# EAGLE design mb_01 (EAGLE 7.6.0)

## Sheet 1 of 6
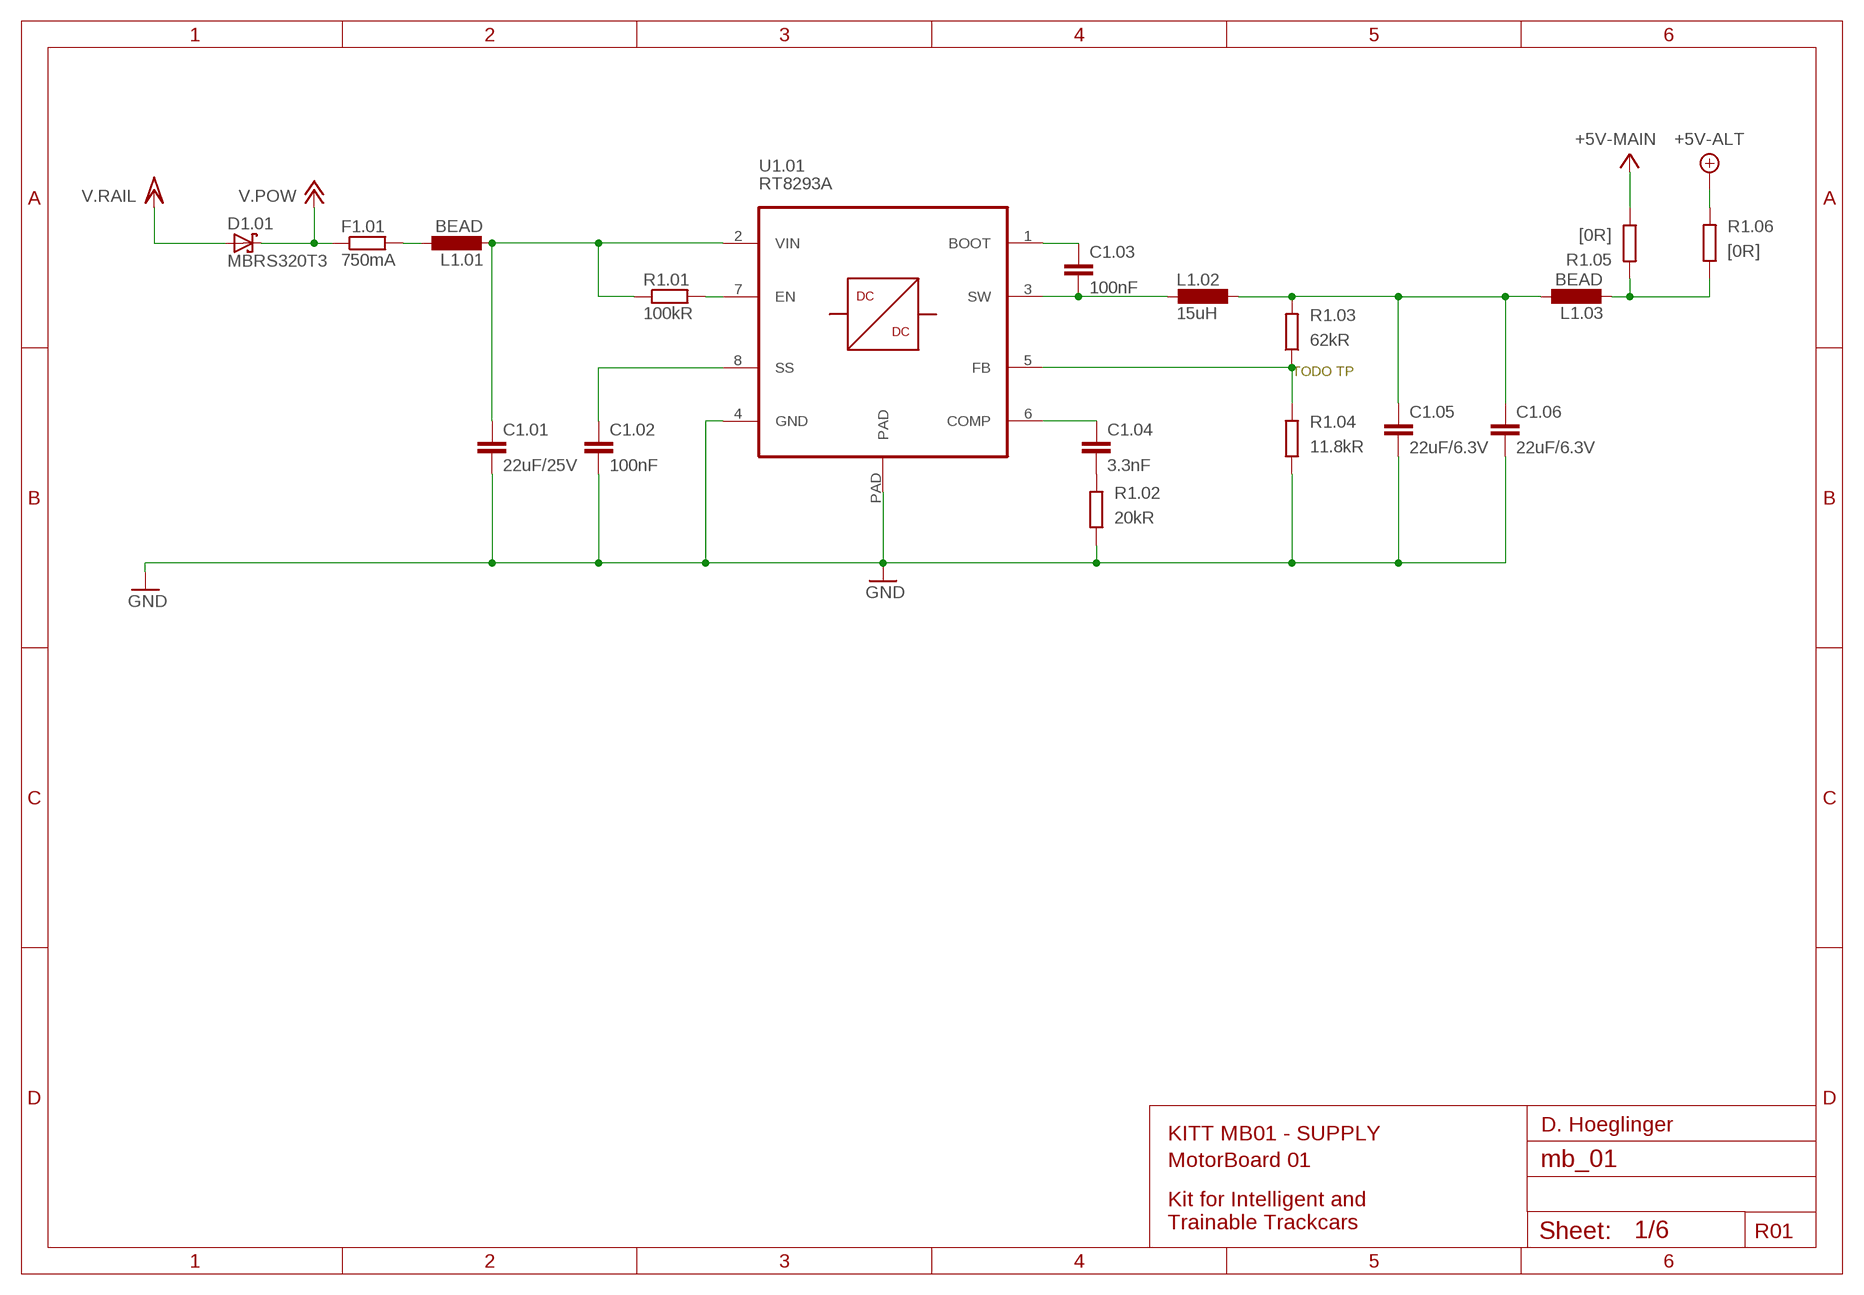
[diagram p0: schematic, sheet 1]

### Parts
C1.01  22uF/25V  C-EUC1210K  [C1210K]
C1.02  100nF  C-EUC0402K  [C0402K]
C1.03  100nF  C-EUC0402K  [C0402K]
C1.04  3.3nF  C-EUC0402K  [C0402K]
C1.05  22uF/6.3V  C-EUC1206K  [C1206K]
C1.06  22uF/6.3V  C-EUC1206K  [C1206K]
D1.01  MBRS320T3  [SMC]
F1.01  750mA  R-EU_R1210  [R1210]
L1.01  BEAD  L-EUL4516C  [L4516C]
L1.02  15uH  NRS8030XX  [TAIYO-YUDEN.NRS8030T4R7MJGJ]
L1.03  BEAD  L-EUL4516C  [L4516C]
R1.01  100kR  R-EU_R0402  [R0402]
R1.02  20kR  R-EU_R0402  [R0402]
R1.03  62kR  R-EU_R0402  [R0402]
R1.04  11.8kR  R-EU_R0402  [R0402]
R1.05  [0R]  R-EU_R0402  [R0402]
R1.06  [0R]  R-EU_R0402  [R0402]
U1.01  RT8293A  [SOIC-8-PAD]

### Nets
+5V: R1.05.1 R1.06.2 ; supply symbol labelled +5V-MAIN, +5V-ALT ; also sheet 2,4,6
+12V: D1.01.C F1.01.1 ; supply symbol labelled V.POW ; also sheet 4,5
GND: C1.01.2 C1.02.2 C1.05.2 C1.06.2 R1.02.1 R1.04.1 U1.01.4(GND) U1.01.PAD ; also sheet 2,3,4,5,6
N$80: F1.01.2 L1.01.1
N$81: C1.01.1 L1.01.2 R1.01.1 U1.01.2(VIN)
N$82: R1.01.2 U1.01.7(EN)
N$83: C1.02.1 U1.01.8(SS)
N$84: C1.04.2 R1.02.2
N$85: C1.04.1 U1.01.6(COMP)
N$86: R1.03.1 R1.04.2 U1.01.5(FB)
N$87: C1.05.1 C1.06.1 L1.02.1 L1.03.1 R1.03.2
N$88: C1.03.2 L1.02.2 U1.01.3(SW)
N$89: C1.03.1 U1.01.1(BOOT)
N$90: L1.03.2 R1.05.2 R1.06.1
VCC/2: D1.01.A ; supply symbol labelled V.RAIL ; also sheet 4

### Notes on the sheet
- TODO TP
- D. Hoeglinger
- KITT MB01 | - SUPPLY
- MotorBoard 01
- Kit for Intelligent and
  Trainable Trackcars
- R01

## Sheet 2 of 6
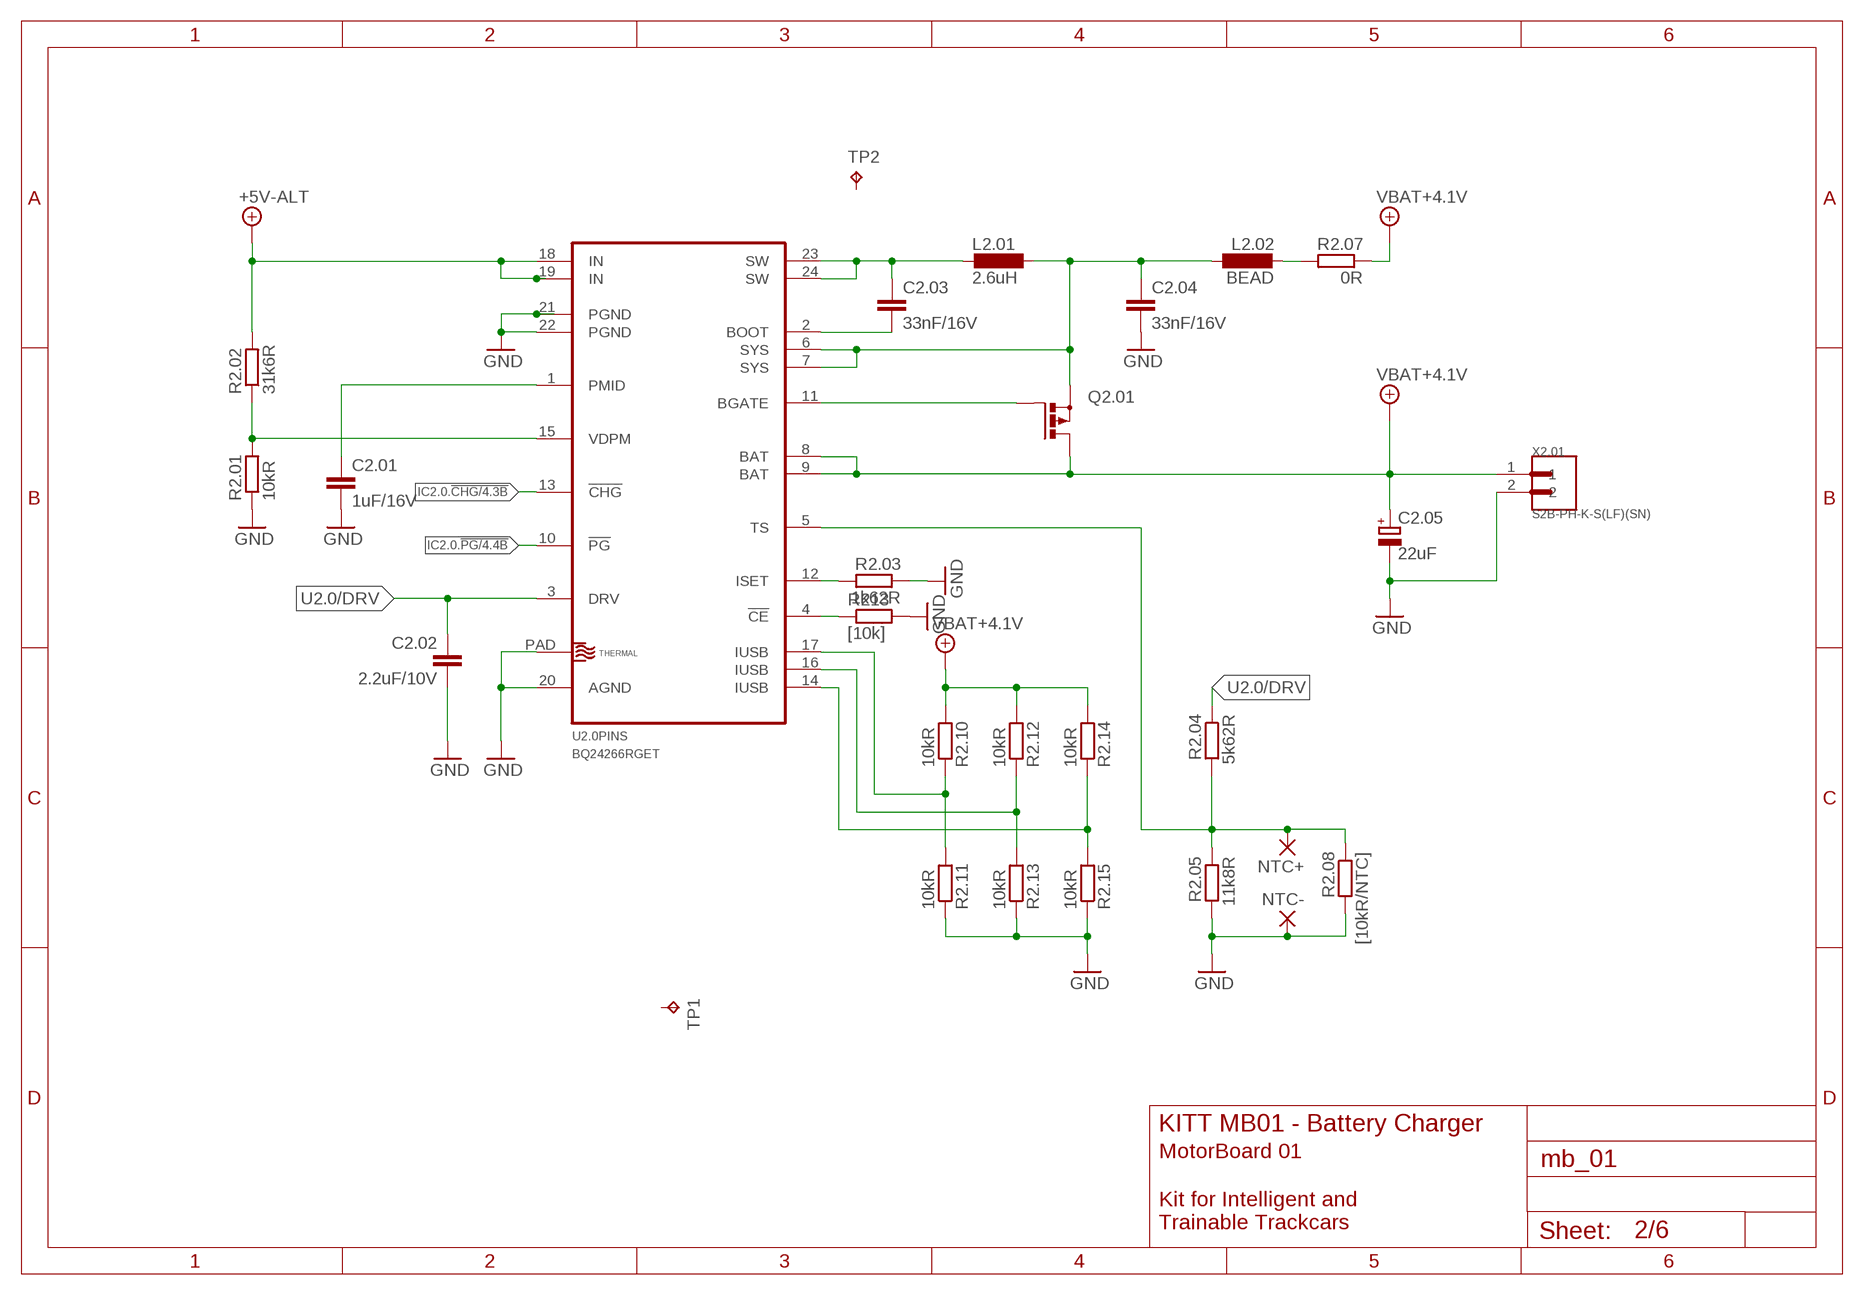
[diagram p1: schematic, sheet 2]

### Parts
C2.01  1uF/16V  C-EUC0805  [C0805]
C2.02  2.2uF/10V  C-EUC0603K  [C0603K]
C2.03  33nF/16V  C-EUC0603  [C0603]
C2.04  33nF/16V  C-EUC0805  [C0805]
C2.05  22uF  CPOL-EUA/3216-18R  [A/3216-18R]
L2.01  2.6uH  NRS8030XX  [TAIYO-YUDEN.NRS8030T4R7MJGJ]
L2.02  BEAD  L-EUL4516C  [L4516C]
NTC+  SMD2  [SMD1,27-2,54]
NTC-  SMD2  [SMD1,27-2,54]
Q2.01  P-MOSFET-SO8  [SO-08]
R2.01  10kR  R-EU_R0402  [R0402]
R2.02  31k6R  R-EU_R0402  [R0402]
R2.03  1k62R  R-EU_R0402  [R0402]
R2.04  5k62R  R-EU_R0402  [R0402]
R2.05  11k8R  R-EU_R0402  [R0402]
R2.07  0R  R-EU_R0402  [R0402]
R2.08  [10kR/NTC]  R-EU_R0402  [R0402]
R2.10  10kR  R-EU_R0402  [R0402]
R2.11  10kR  R-EU_R0402  [R0402]
R2.12  10kR  R-EU_R0402  [R0402]
R2.13  10kR  R-EU_R0402  [R0402]
R2.14  10kR  R-EU_R0402  [R0402]
R2.15  10kR  R-EU_R0402  [R0402]
R213  [10k]  R-EU_01005  [R01005]
TP1  TPTP07R  [TP07R]
TP2  TPTP07R  [TP07R]
U2.0  BQ24266RGET  [VQFN-24]
X2.01  S2B-PH-K-S(LF)(SN)  [JST_S2B-PH-K-S(LF)(SN)]

### Nets
+4.1V: C2.05.+ Q2.01.5(D) Q2.01.6(D) Q2.01.7(D) Q2.01.8(D) R2.07.1 R2.10.2 R2.12.2 R2.14.2 U2.0.8(PINS:BAT) U2.0.9(PINS:BAT) X2.01.1 ; supply symbol labelled VBAT+4.1V ; also sheet 6
+5V: R2.02.2 U2.0.18(PINS:IN) U2.0.19(PINS:IN) ; supply symbol labelled +5V-ALT ; also sheet 1,4,6
GND: C2.01.2 C2.02.2 C2.04.2 C2.05.- NTC-.1(P) R2.01.1 R2.03.1 R2.05.2 R2.08.2 R2.11.1 R2.13.1 R2.15.1 R213.2 U2.0.20(PINS:AGND) U2.0.21(PINS:PGND) U2.0.22(PINS:PGND) U2.0.PAD(PAD:THERMAL) X2.01.2 ; also sheet 1,3,4,5,6
IC2.0.!CHG: U2.0.13(PINS:!CHG) ; also sheet 4
IC2.0.!PG: U2.0.10(PINS:!PG) ; also sheet 4
N$8: R213.1 U2.0.4(PINS:!CE)
N$11: R2.01.2 R2.02.1 U2.0.15(PINS:VDPM)
N$16: L2.02.2 R2.07.2
N$19: R2.03.2 U2.0.12(PINS:ISET)
N$20: R2.10.1 R2.11.2 U2.0.17(PINS:IUSB)
N$21: R2.12.1 R2.13.2 U2.0.16(PINS:IUSB)
N$22: R2.14.1 R2.15.2 U2.0.14(PINS:IUSB)
U2.0/BGATE: Q2.01.4(G) U2.0.11(PINS:BGATE)
U2.0/BOOT: C2.03.2 U2.0.2(PINS:BOOT)
U2.0/DRV: C2.02.1 R2.04.1 U2.0.3(PINS:DRV)
U2.0/PMID: C2.01.1 U2.0.1(PINS:PMID)
U2.0/SW: C2.03.1 L2.01.2 U2.0.23(PINS:SW) U2.0.24(PINS:SW)
U2.0/SYS: C2.04.1 L2.01.1 L2.02.1 Q2.01.1(S) Q2.01.2(S) Q2.01.3(S) U2.0.6(PINS:SYS) U2.0.7(PINS:SYS)
U2.0/TS: NTC+.1(P) R2.04.2 R2.05.1 R2.08.1 U2.0.5(PINS:TS)
Unconnected: TP1.TP TP2.TP

### Notes on the sheet
- KITT MB01 - Battery Charger
- MotorBoard 01
- Kit for Intelligent and
  Trainable Trackcars

## Sheet 3 of 6
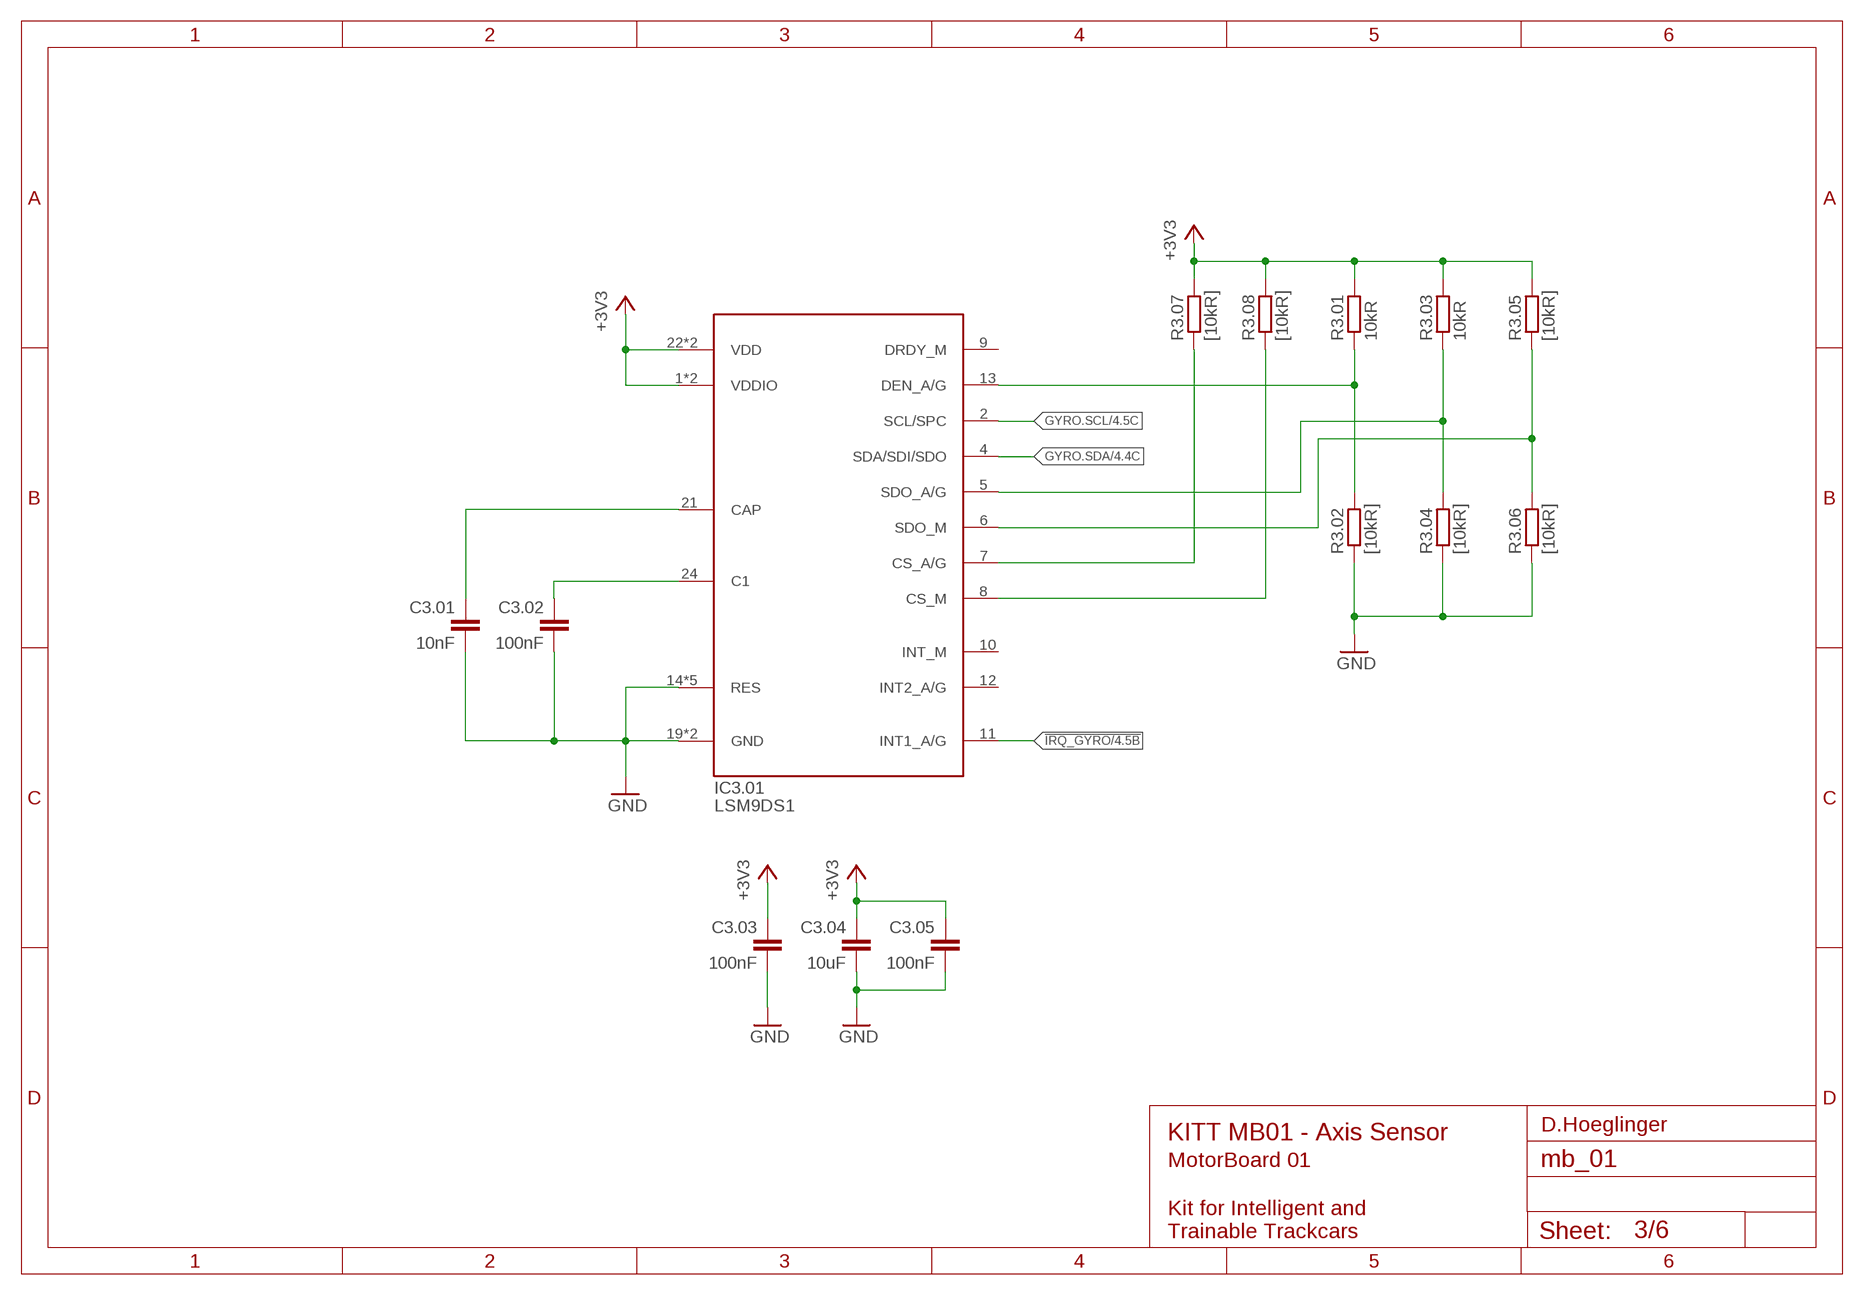
[diagram p2: schematic, sheet 3]

### Parts
C3.01  10nF  C-EUC0603  [C0603]
C3.02  100nF  C-EUC0402  [C0402]
C3.03  100nF  C-EUC0402  [C0402]
C3.04  10uF  C-EUC0603K  [C0603K]
C3.05  100nF  C-EUC0402  [C0402]
IC3.01  LSM9DS1  [LGA-24]
R3.01  10kR  R-EU_R0402  [R0402]
R3.02  [10kR]  R-EU_R0402  [R0402]
R3.03  10kR  R-EU_R0402  [R0402]
R3.04  [10kR]  R-EU_R0402  [R0402]
R3.05  [10kR]  R-EU_R0402  [R0402]
R3.06  [10kR]  R-EU_R0402  [R0402]
R3.07  [10kR]  R-EU_R0402  [R0402]
R3.08  [10kR]  R-EU_R0402  [R0402]

### Nets
!IRQ_GYRO: IC3.01.11(INT1_A/G) ; also sheet 4
+3V3: C3.03.1 C3.04.1 C3.05.1 IC3.01.1(VDDIO) IC3.01.3(VDDIO) IC3.01.22(VDD) IC3.01.23(VDD) R3.01.2 R3.03.2 R3.05.2 R3.07.2 R3.08.2 ; also sheet 4,6
GND: C3.01.2 C3.02.2 C3.03.2 C3.04.2 C3.05.2 IC3.01.14(RES) IC3.01.15(RES) IC3.01.16(RES) IC3.01.17(RES) IC3.01.18(RES) IC3.01.19(GND) IC3.01.20(GND) R3.02.1 R3.04.1 R3.06.1 ; also sheet 1,2,4,5,6
GYRO.SCL: IC3.01.2(SCL/SPC) ; also sheet 4
GYRO.SDA: IC3.01.4(SDA/SDI/SDO) ; also sheet 4
N$1: C3.01.1 IC3.01.21(CAP)
N$6: C3.02.1 IC3.01.24(C1)
N$17: IC3.01.13(DEN_A/G) R3.01.1 R3.02.2
N$23: IC3.01.5(SDO_A/G) R3.03.1 R3.04.2
N$24: IC3.01.7(CS_A/G) R3.07.1
N$26: IC3.01.6(SDO_M) R3.05.1 R3.06.2
N$27: IC3.01.8(CS_M) R3.08.1
Unconnected: IC3.01.9(DRDY_M) IC3.01.10(INT_M) IC3.01.12(INT2_A/G)

### Notes on the sheet
- D.Hoeglinger
- KITT MB01 - Axis Sensor
- MotorBoard 01
- Kit for Intelligent and
  Trainable Trackcars

## Sheet 4 of 6
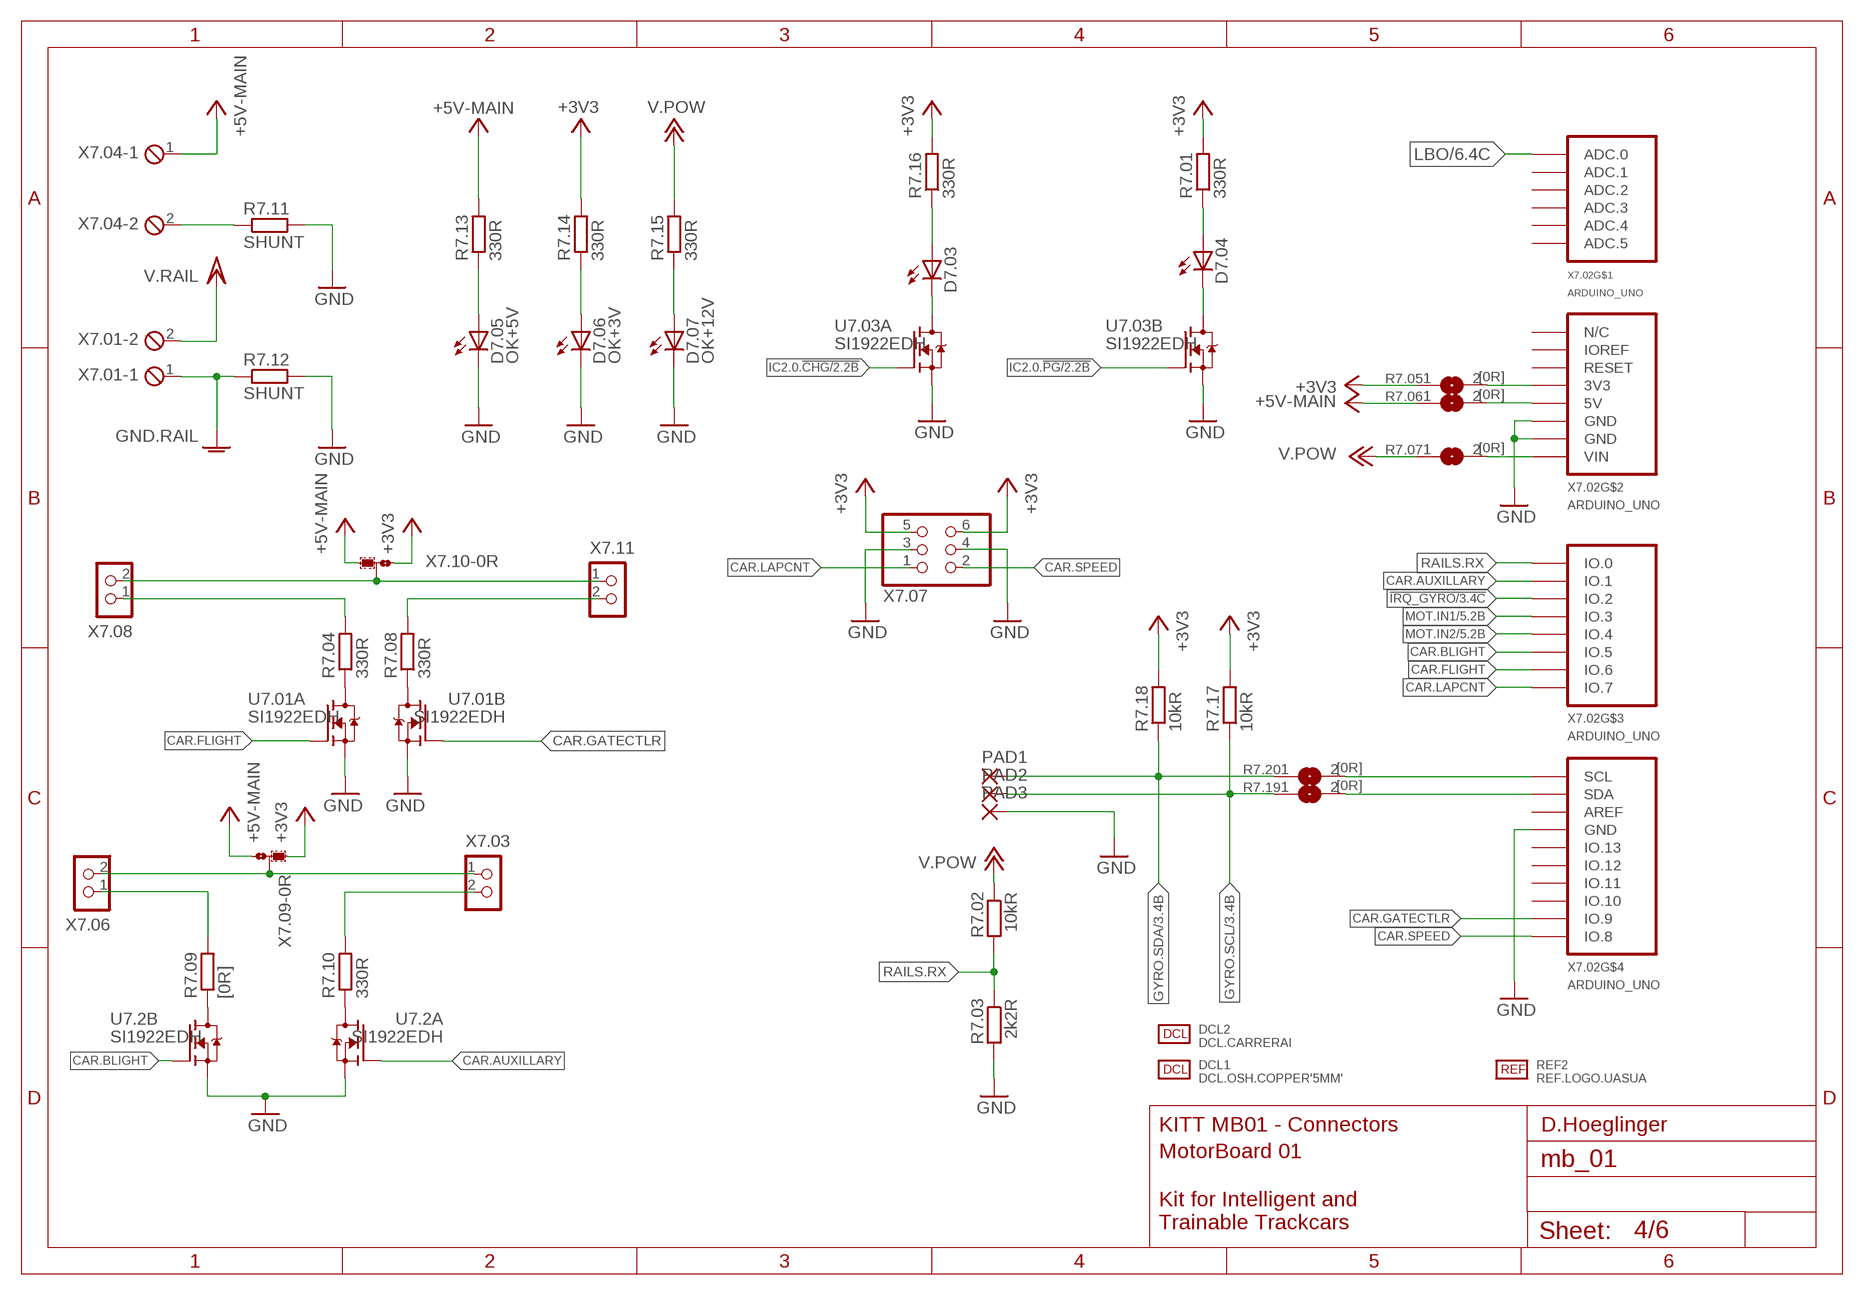
[diagram p3: schematic, sheet 4]

### Parts
D7.03  LEDCHIPLED_1206  [CHIPLED_1206]
D7.04  LEDCHIPLED_1206  [CHIPLED_1206]
D7.05  OK+5V  LEDCHIPLED_1206  [CHIPLED_1206]
D7.06  OK+3V  LEDCHIPLED_1206  [CHIPLED_1206]
D7.07  OK+12V  LEDCHIPLED_1206  [CHIPLED_1206]
DCL1  DCL.OSH.COPPER'5MM'  [DCL.LOGO-OSH.5MM]
DCL2  DCL.CARRERAI  [DCL.LOGO-CARRERAI.W30MM]
PAD1  SMD2  [SMD1,27-2,54]
PAD2  SMD2  [SMD1,27-2,54]
PAD3  SMD2  [SMD1,27-2,54]
R7.01  330R  R-EU_R0603  [R0603]
R7.02  10kR  R-EU_M0805  [M0805]
R7.03  2k2R  R-EU_M0805  [M0805]
R7.04  330R  R-EU_R0603  [R0603]
R7.05  [0R]  SJ  [SJ]
R7.06  [0R]  SJ  [SJ]
R7.07  [0R]  SJ  [SJ]
R7.08  330R  R-EU_R0603  [R0603]
R7.09  [0R]  R-EU_R0603  [R0603]
R7.10  330R  R-EU_R0603  [R0603]
R7.11  SHUNT  R-EU_R1206  [R1206]
R7.12  SHUNT  R-EU_R1206  [R1206]
R7.13  330R  R-EU_R0603  [R0603]
R7.14  330R  R-EU_R0603  [R0603]
R7.15  330R  R-EU_R0603  [R0603]
R7.16  330R  R-EU_R0603  [R0603]
R7.17  10kR  R-EU_R0402  [R0402]
R7.18  10kR  R-EU_R0402  [R0402]
R7.19  [0R]  SJ  [SJ]
R7.20  [0R]  SJ  [SJ]
REF2  REF.LOGO.UASUA  [REF_LOGO_UASUA]
U7.01  SI1922EDH  [SC70-6]
U7.2  SI1922EDH  [SC70-6]
U7.03  SI1922EDH  [SC70-6]
X7.01  MPT2  [2POL254]
X7.02  ARDUINO_UNO  [AU_PINS]
X7.03  CON_HEADER_1X02  [M1X2_MALE_RIGHT_ANGLED_SMD]
X7.04  MPT2  [2POL254]
X7.06  CON_HEADER_1X02  [M1X2_MALE_RIGHT_ANGLED_SMD]
X7.07  PINHD-2X3/90  [2X03/90]
X7.08  CON_HEADER_1X02  [M1X2_MALE_RIGHT_ANGLED_SMD]
X7.09  0R-JUMPA  [A0R-JMP]
X7.10  0R-JUMPA  [A0R-JMP]
X7.11  CON_HEADER_1X02  [M1X2_MALE_RIGHT_ANGLED_SMD]

### Nets
!IRQ_GYRO: X7.02.IO.2 ; also sheet 3
+3V3: R7.01.2 R7.05.1 R7.14.2 R7.16.2 R7.17.2 R7.18.2 X7.07.5 X7.07.6 X7.09.1 X7.10.1 ; also sheet 3,6
+5V: R7.06.1 R7.13.2 X7.04.1 X7.09.3 X7.10.3 ; supply symbol labelled +5V-MAIN ; also sheet 1,2,6
+12V: R7.02.1 R7.07.1 R7.15.2 ; supply symbol labelled V.POW ; also sheet 1,5
CAR.AUXILLARY: U7.2.2(A:G) X7.02.IO.1
CAR.BLIGHT: U7.2.5(B:G) X7.02.IO.5
CAR.FLIGHT: U7.01.2(A:G) X7.02.IO.6
CAR.GATECTLR: U7.01.5(B:G) X7.02.IO.9
CAR.LAPCNT: X7.02.IO.7 X7.07.1
CAR.SPEED: X7.02.IO.8 X7.07.2
GND: D7.05.C D7.06.C D7.07.C PAD3.1(P) R7.03.2 R7.11.2 R7.12.2 U7.01.1(A:S) U7.01.4(B:S) U7.2.1(A:S) U7.2.4(B:S) U7.03.1(A:S) U7.03.4(B:S) X7.02.GND2(GND) X7.02.GND3(GND) X7.02.GND.1(GND) X7.07.3 X7.07.4 ; also sheet 1,2,3,5,6
GNDA: R7.12.1 X7.01.1 ; supply symbol labelled GND.RAIL
GYRO.SCL: PAD2.1(P) R7.17.1 R7.19.1 ; also sheet 3
GYRO.SDA: PAD1.1(P) R7.18.1 R7.20.1 ; also sheet 3
IC2.0.!CHG: U7.03.2(A:G) ; also sheet 2
IC2.0.!PG: U7.03.5(B:G) ; also sheet 2
LBO: X7.02.ADC.0 ; also sheet 6
MOT.IN1: X7.02.IO.3 ; also sheet 5
MOT.IN2: X7.02.IO.4 ; also sheet 5
N$2: R7.04.1 U7.01.6(A:D)
N$3: R7.05.2 X7.02.3.3V(3V3)
N$4: R7.06.2 X7.02.5V
N$5: R7.07.2 X7.02.VIN
N$7: R7.08.1 U7.01.3(B:D)
N$25: R7.11.1 X7.04.2
N$28: D7.03.C U7.03.6(A:D)
N$29: D7.03.A R7.16.1
N$30: D7.04.A R7.01.1
N$31: D7.04.C U7.03.3(B:D)
N$32: D7.05.A R7.13.1
N$38: D7.06.A R7.14.1
N$42: R7.04.2 X7.08.1
N$44: D7.07.A R7.15.1
N$45: X7.08.2 X7.10.2 X7.11.1
N$46: R7.09.2 X7.06.1
N$47: R7.09.1 U7.2.3(B:D)
N$48: X7.03.1 X7.06.2 X7.09.2
N$49: R7.19.2 X7.02.SDA
N$50: R7.08.2 X7.11.2
N$51: R7.10.1 U7.2.6(A:D)
N$52: R7.10.2 X7.03.2
N$53: R7.20.2 X7.02.SCL
RAILS.RX: R7.02.2 R7.03.1 X7.02.IO.0
VCC/2: X7.01.2 ; supply symbol labelled V.RAIL ; also sheet 1
Unconnected: X7.02.ADC.1 X7.02.ADC.2 X7.02.ADC.3 X7.02.ADC.4 X7.02.ADC.5 X7.02.AREF X7.02.I/OREF(IOREF) X7.02.IO.10 X7.02.IO.11 X7.02.IO.12 X7.02.IO.13 X7.02.N/C X7.02.RESET

### Notes on the sheet
- KITT MB01 - Connectors | D.Hoeglinger
- MotorBoard 01
- Kit for Intelligent and
  Trainable Trackcars

## Sheet 5 of 6
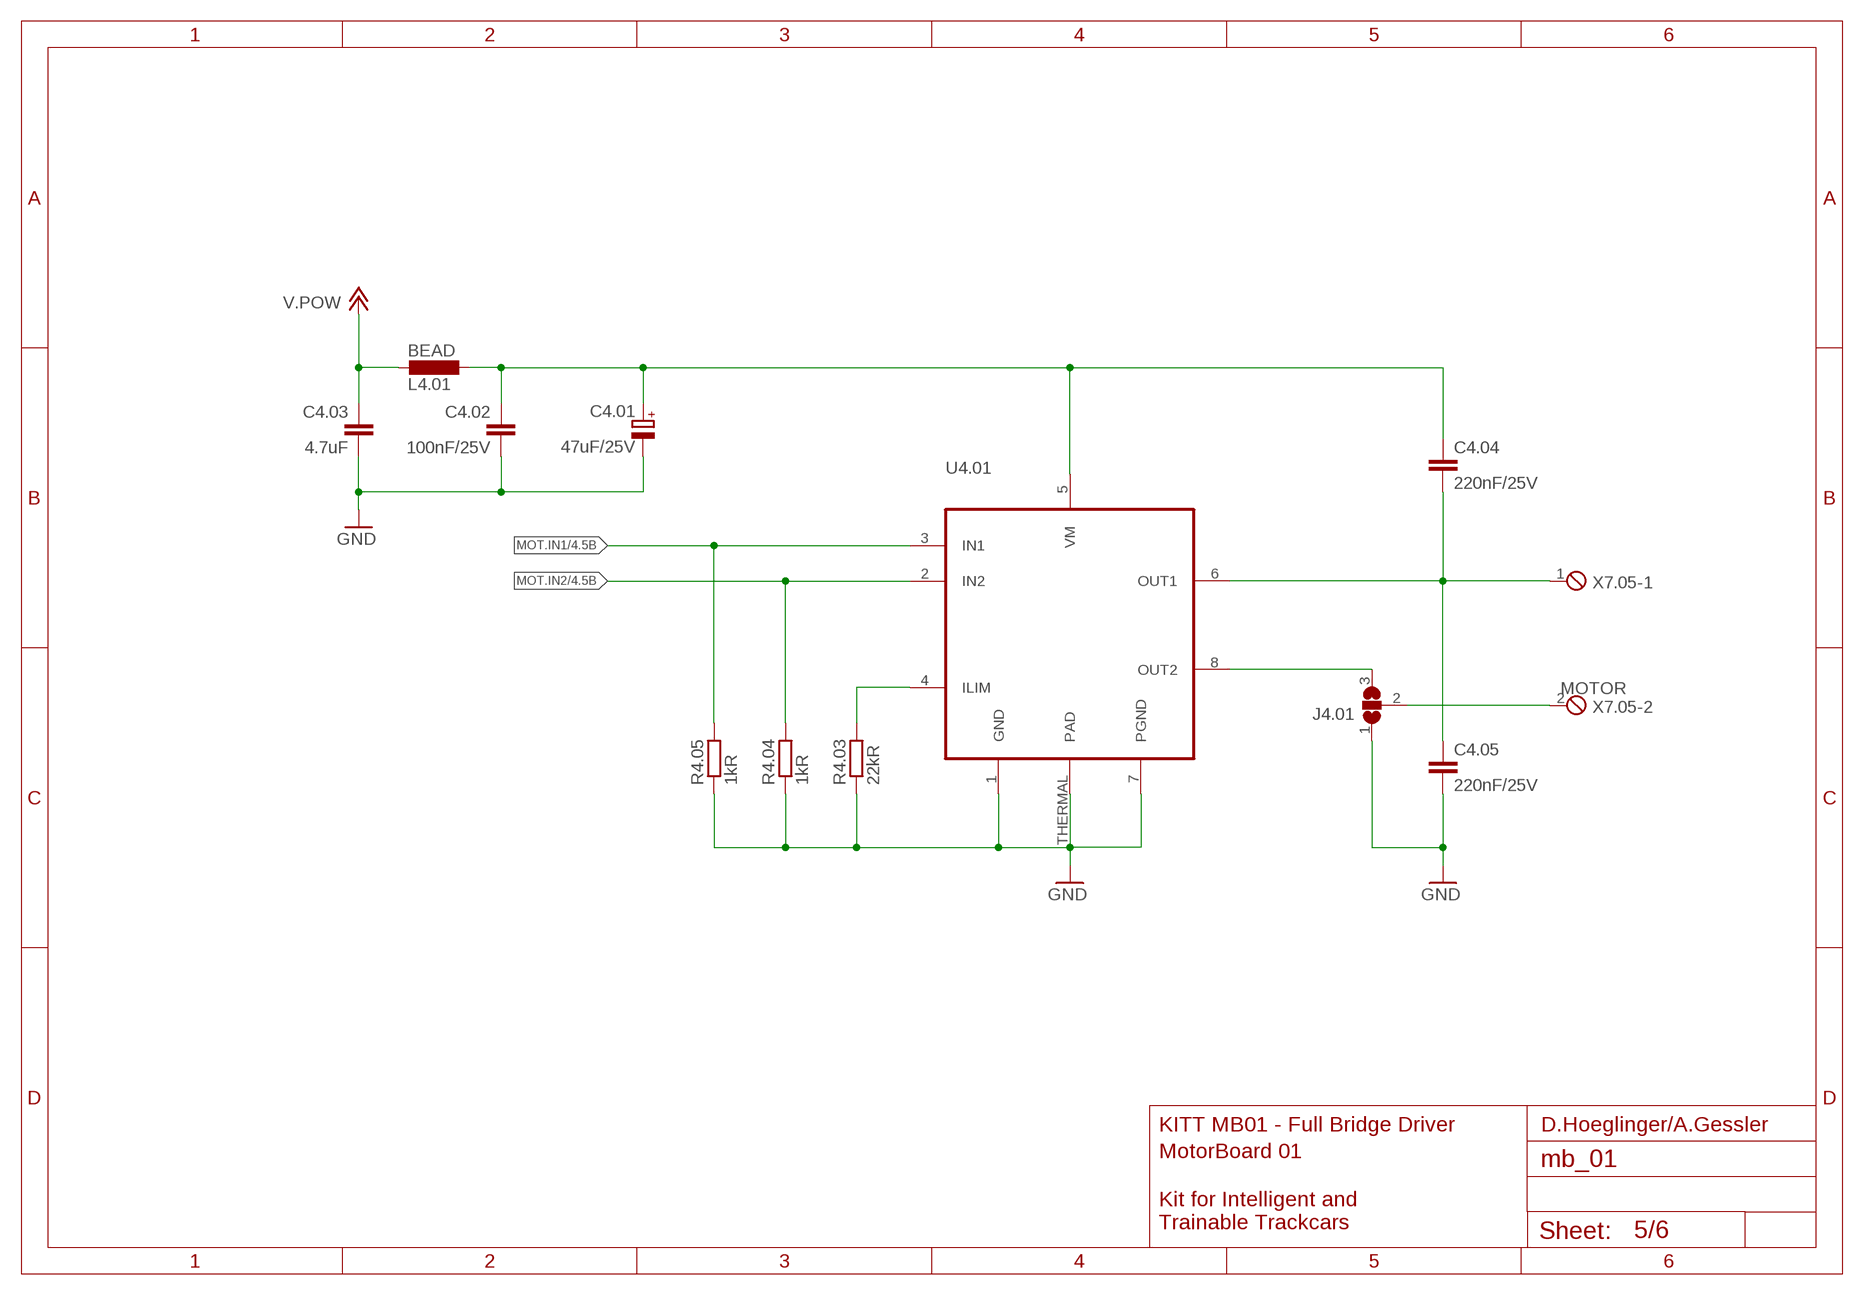
[diagram p4: schematic, sheet 5]

### Parts
C4.01  47uF/25V  CPOL-EUC/6032-28R  [C/6032-28R]
C4.02  100nF/25V  C-EUC0603K  [C0603K]
C4.03  4.7uF  C-EUC0805K  [C0805K]
C4.04  220nF/25V  C-EUC0603K  [C0603K]
C4.05  220nF/25V  C-EUC0603K  [C0603K]
J4.01  SJ2W  [SJ_2]
L4.01  BEAD  L-EUL4516C  [L4516C]
R4.03  22kR  R-EU_R0402  [R0402]
R4.04  1kR  R-EU_R0402  [R0402]
R4.05  1kR  R-EU_R0402  [R0402]
U4.01  DRV8871  [HSOP8]
X7.05  MOTOR  MPT2  [2POL254]

### Nets
+12V: C4.03.1 L4.01.2 ; supply symbol labelled V.POW ; also sheet 1,4
GND: C4.01.- C4.02.2 C4.03.2 C4.05.2 J4.01.1 R4.03.1 R4.04.1 R4.05.1 U4.01.1(GND) U4.01.7(PGND) U4.01.THERMAL(PAD) ; also sheet 1,2,3,4,6
MOT.IN1: R4.05.2 U4.01.3(IN1) ; also sheet 4
MOT.IN2: R4.04.2 U4.01.2(IN2) ; also sheet 4
N$9: J4.01.2 X7.05.2
N$10: C4.01.+ C4.02.1 C4.04.1 L4.01.1 U4.01.5(VM)
N$33: C4.04.2 C4.05.1 U4.01.6(OUT1) X7.05.1
N$34: J4.01.3 U4.01.8(OUT2)
N$35: R4.03.2 U4.01.4(ILIM)

### Notes on the sheet
- KITT MB01 - Full Bridge Driver | D.Hoeglinger/A.Gessler
- MotorBoard 01
- Kit for Intelligent and
  Trainable Trackcars

## Sheet 6 of 6
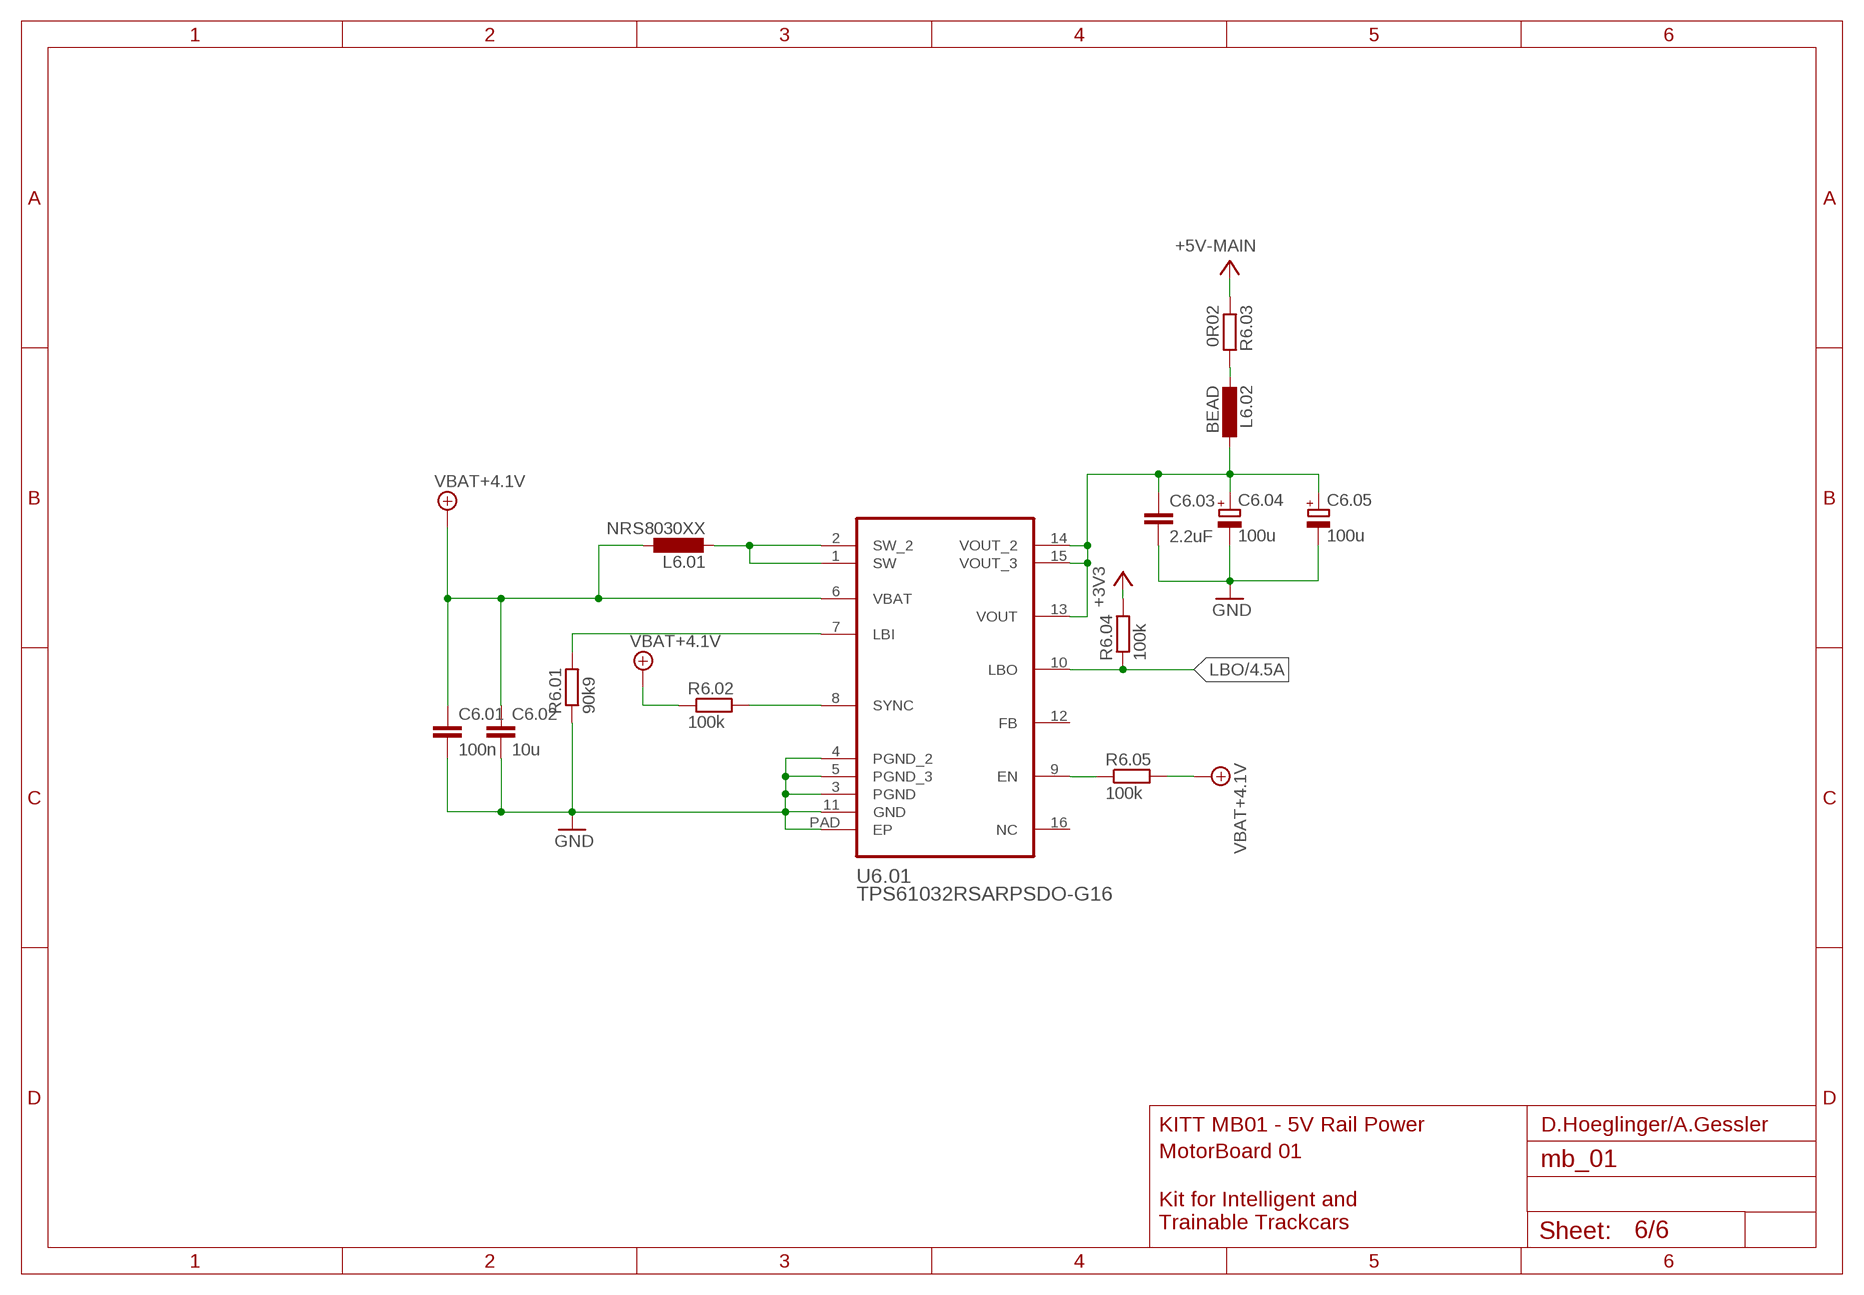
[diagram p5: schematic, sheet 6]

### Parts
C6.01  100n  C-EUC0402  [C0402]
C6.02  10u  C-EUC0603  [C0603]
C6.03  2.2uF  C-EUC0603  [C0603]
C6.04  100u  CPOL-29172312  [C-2312]
C6.05  100u  CPOL-29172312  [C-2312]
L6.01  NRS8030XX  [TAIYO-YUDEN.NRS8030T4R7MJGJ]
L6.02  BEAD  L-EUL4516C  [L4516C]
R6.01  90k9  R-EU_R0402  [R0402]
R6.02  100k  R-EU_R0402  [R0402]
R6.03  0R02  R-EU_R0805  [R0805]
R6.04  100k  R-EU_R0402  [R0402]
R6.05  100k  R-EU_R0402  [R0402]
U6.01  TPS61032RSARPSDO-G16  [R-PDSO-G16]

### Nets
+3V3: R6.04.2 ; also sheet 3,4
+4.1V: C6.01.1 C6.02.1 L6.01.1 R6.02.1 R6.05.2 U6.01.6(VBAT) ; supply symbol labelled VBAT+4.1V ; also sheet 2
+5V: R6.03.1 ; supply symbol labelled +5V-MAIN ; also sheet 1,2,4
GND: C6.01.2 C6.02.2 C6.03.2 C6.04.N(-) C6.05.N(-) R6.01.1 U6.01.3(PGND) U6.01.4(PGND_2) U6.01.5(PGND_3) U6.01.11(GND) U6.01.PAD(EP) ; also sheet 1,2,3,4,5
LBO: R6.04.1 U6.01.10(LBO) ; also sheet 4
N$36: L6.02.2 R6.03.2
N$37: R6.05.1 U6.01.9(EN)
N$39: L6.01.2 U6.01.1(SW) U6.01.2(SW_2)
N$40: R6.01.2 U6.01.7(LBI)
N$41: R6.02.2 U6.01.8(SYNC)
N$43: C6.03.1 C6.04.P(+) C6.05.P(+) L6.02.1 U6.01.13(VOUT) U6.01.14(VOUT_2) U6.01.15(VOUT_3)
Unconnected: U6.01.12(FB) U6.01.16(NC)

### Notes on the sheet
- KITT MB01 - 5V Rail Power | D.Hoeglinger/A.Gessler
- MotorBoard 01
- Kit for Intelligent and
  Trainable Trackcars

## Library data of the parts
C1.01-C1.06 C2.01-C2.04 C3.01-C3.03 C3.05 C4.04 C4.05 C6.01-C6.03 = rcl:C-EU: CAPACITOR, European symbol
C2.05 C4.01 = rcl:CPOL-EU: POLARIZED CAPACITOR, European symbol
C3.04 C4.02 C4.03 = resistor:C-EU: CAPACITOR, European symbol
C6.04 C6.05 = kitt.psvs:CPOL-2917
D1.01 = diode:MBRS3*0T3: SCHOTTKY BARRIER RECTIFIER 3.0 AMPERES 20, 30, 40 VOLT Source: MBRS340T3-D.pdf
D7.03-D7.07 = led:LED: LED OSRAM: - CHIPLED LG R971, LG N971, LY N971, LG Q971, LY Q971, LO R971, LY R971 LH N974, LH R974 LS Q976, LO Q976, LY Q976 LO Q996 - Hyper CHIPLED LW Q18S LB Q993, LB Q99A, LB R99A - SideLED LS A670, LO A670, LY A670, LG A670, LP A670 LB A673, LV A673, LT A673, LW A673 LH A674 LY A675 LS A676, LA A676, LO A676, LY A676, LW A676 LS A679, LY A679, LG A679 - Hyper Micro SIDELED® LS Y876, LA Y876, LO Y876, LY Y876 LT Y87S - SmartLED LW L88C, LW L88S LB L89C, LB L89S, LG L890 LS L89K, LO L89K, LY L89K LS L896, LA L896, LO L896, LY L896 - TOPLED LS T670, LO T670, LY T670, LG T670, LP T670 LSG T670, LSP T670, LSY T670, LOP T670, LYG T670 LG T671, LOG T671, LSG T671 LB T673, LV T673, LT T673, LW T673 LH T674 LS T676, LA T676, LO T676, LY T676, LB T676, LH T676, LSB T676, LW T676 LB T67C, LV T67C, LT T67C, LS T67K, LO T67K, LY T67K, LW E67C LS E67B, LA E67B, LO E67B, LY E67B, LB E67C, LV E67C, LT E67C LW T67C LS T679, LY T679, LG T679 LS T770, LO T770, LY T770, LG T770, LP T770 LB T773, LV T773, LT T773, LW T773 LH T774 LS E675, LA E675, LY E675, LS T675 LS T776, LA T776, LO T776, LY T776, LB T776 LHGB T686 LT T68C, LB T68C - Hyper Mini TOPLED® LB M676 - Mini TOPLED Santana® LG M470 LS M47K, LO M47K, LY M47K Source: http://www.osram.convergy.de LUXEON: - LUMILED® LXK2-PW12-R00, LXK2-PW12-S00, LXK2-PW14-U00, LXK2-PW14-V00 LXK2-PM12-R00, LXK2-PM12-S00, LXK2-PM14-U00 LXK2-PE12-Q00, LXK2-PE12-R00, LXK2-PE12-S00, LXK2-PE14-T00, LXK2-PE14-U00 LXK2-PB12-K00, LXK2-PB12-L00, LXK2-PB12-M00, LXK2-PB14-N00, LXK2-PB14-P00, LXK2-PB14-Q00 LXK2-PR12-L00, LXK2-PR12-M00, LXK2-PR14-Q00, LXK2-PR14-R00 LXK2-PD12-Q00, LXK2-PD12-R00, LXK2-PD12-S00 LXK2-PH12-R00, LXK2-PH12-S00 LXK2-PL12-P00, LXK2-PL12-Q00, LXK2-PL12-R00 Source: www.luxeon.com KINGBRIGHT: KA-3528ASYC Source: www.kingbright.com
DCL1 = kitt.refs:DCL.OSH.COPPER
DCL2 = kitt.refs:DCL.CARRERAI
F1.01 R1.01-R1.06 R2.01-R2.05 R2.07 R2.08 R2.10-R2.15 R3.01-R3.08 R6.01-R6.05 R7.01-R7.04 R7.08 R7.09 R7.10-R7.18 R213 = rcl:R-EU_: RESISTOR, European symbol
IC3.01 = kitt.ic:LSM9DS1; AVAILABILITY: Unavailable; DESCRIPTION: iNEMO inertial module: 3D accelerometer, 3D gyroscope, 3D magnetometer; MF: STMicroelectronics; MP: LSM9DS1; PACKAGE: None; PRICE: None
J4.01 = jumper:SJ2W: SMD solder JUMPER
L1.01 L1.03 L2.02 L4.01 L6.02 = rcl:L-EU: INDUCTOR, European symbol
L1.02 L2.01 L6.01 = kitt.psvs:NRS8030XX
NTC+ NTC- PAD1-PAD3 = wirepad:SMD2: SMD PAD
Q2.01 = transistor-power:P-MOSFET-SO8: P-Channel MOSFET Example: FDS4435A; P-Channel Logic Level PowerTrench® MOSFET FDS4465; P-Channel 1.8V Specified PowerTrench® MOSFET Source: www.fairchildsemi.com
R4.03-R4.05 = resistor:R-EU_: RESISTOR, European symbol
R7.05-R7.07 R7.19 R7.20 = jumper:SJ: SMD solder JUMPER
REF2 = kitt.refs:REF.LOGO.UASUA
TP1 TP2 = testpad:TP: Test pad
U1.01 = kitt.ic:RT8293A
U2.0 = kitt.ic:BQ24266RGET
U4.01 = kitt.ic:DRV8871
U6.01 = kitt.ic:TPS61032RSAR: SYNCHRONOUS BOOST CONVERTER
U7.01 U7.2 U7.03 = kitt.ic:SI1922EDH
X2.01 = kitt.con:S2B-PH-K-S(LF)(SN): PH Series 2 Position 2.0 mm Through Hole Side Entry Shrouded Header; AVAILABILITY: Good; DESCRIPTION: PH Series 2 Position 2.0 mm Through Hole Side Entry Shrouded Header; MF: JST; MP: S2B-PH-K-S(LF)(SN); PACKAGE: FakePackage u; PRICE: 0.08 USD
X7.01 X7.04 X7.05 = con-phoenix-254:MPT2: PHOENIX CONNECTOR; OC_FARNELL: unknown; OC_NEWARK: unknown
X7.02 = kitt.con:ARDUINO_UNO
X7.03 X7.06 X7.08 X7.11 = kitt.con:CON_HEADER_1X02
X7.07 = pinhead:PINHD-2X3: PIN HEADER
X7.09 X7.10 = jump-0r-smd:0R-JUMP: SMD 0R 0805 Jumper

## Board
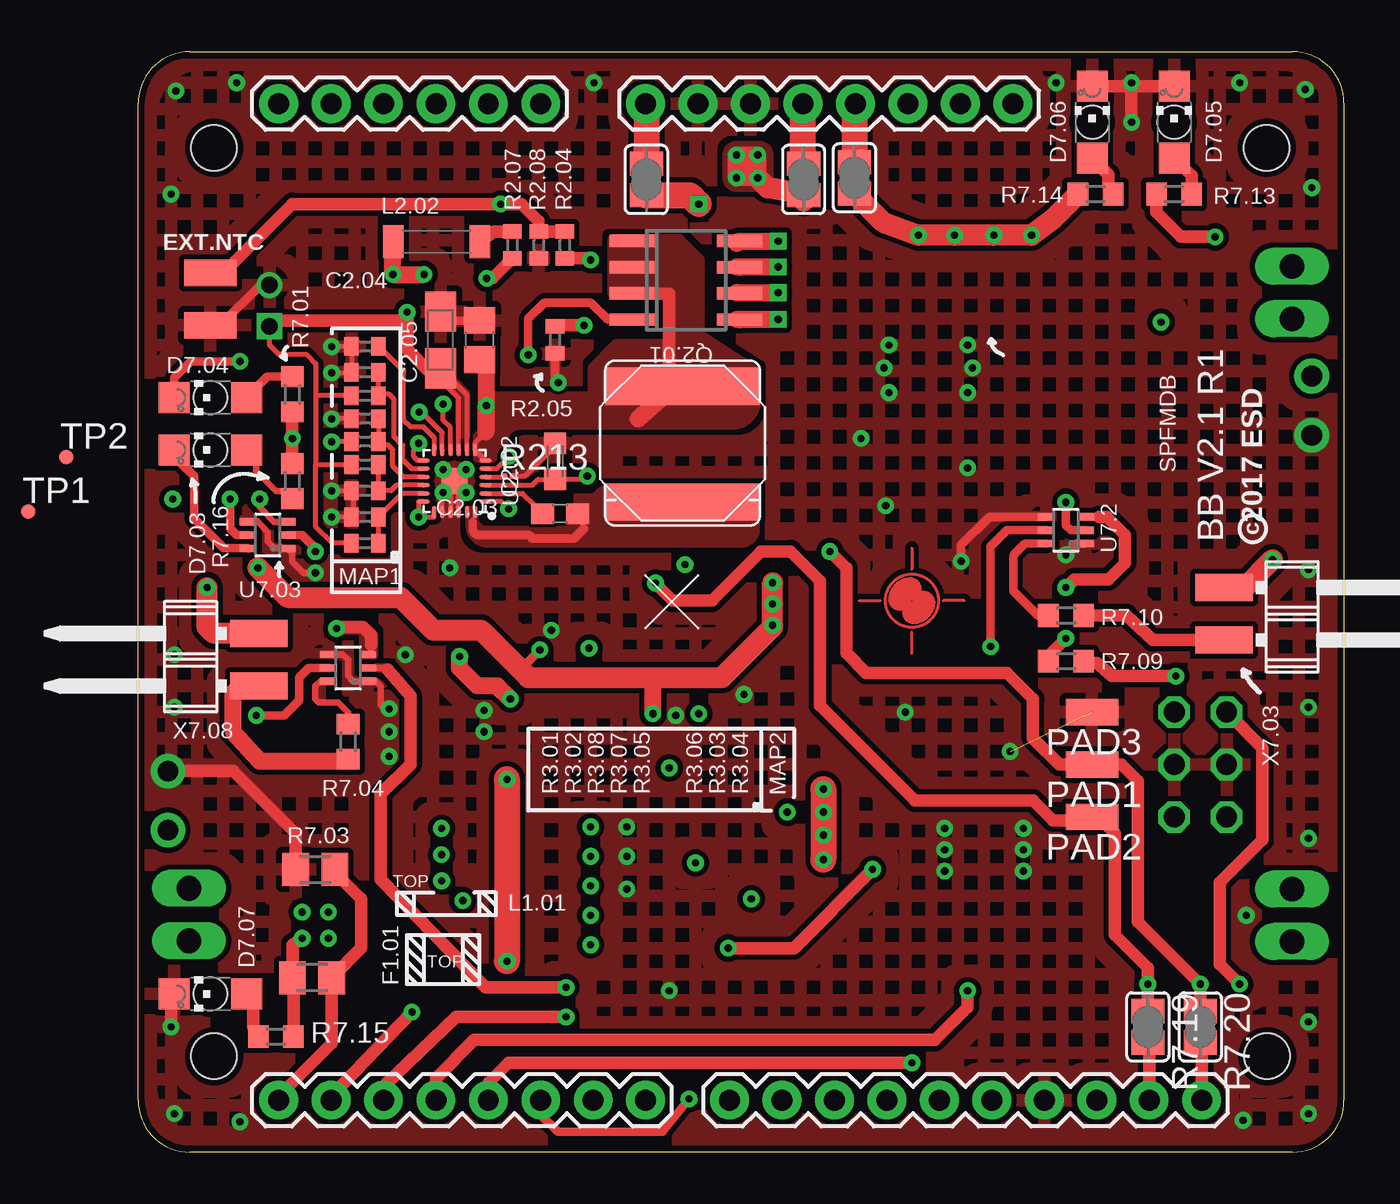
[diagram p6: board, top side]
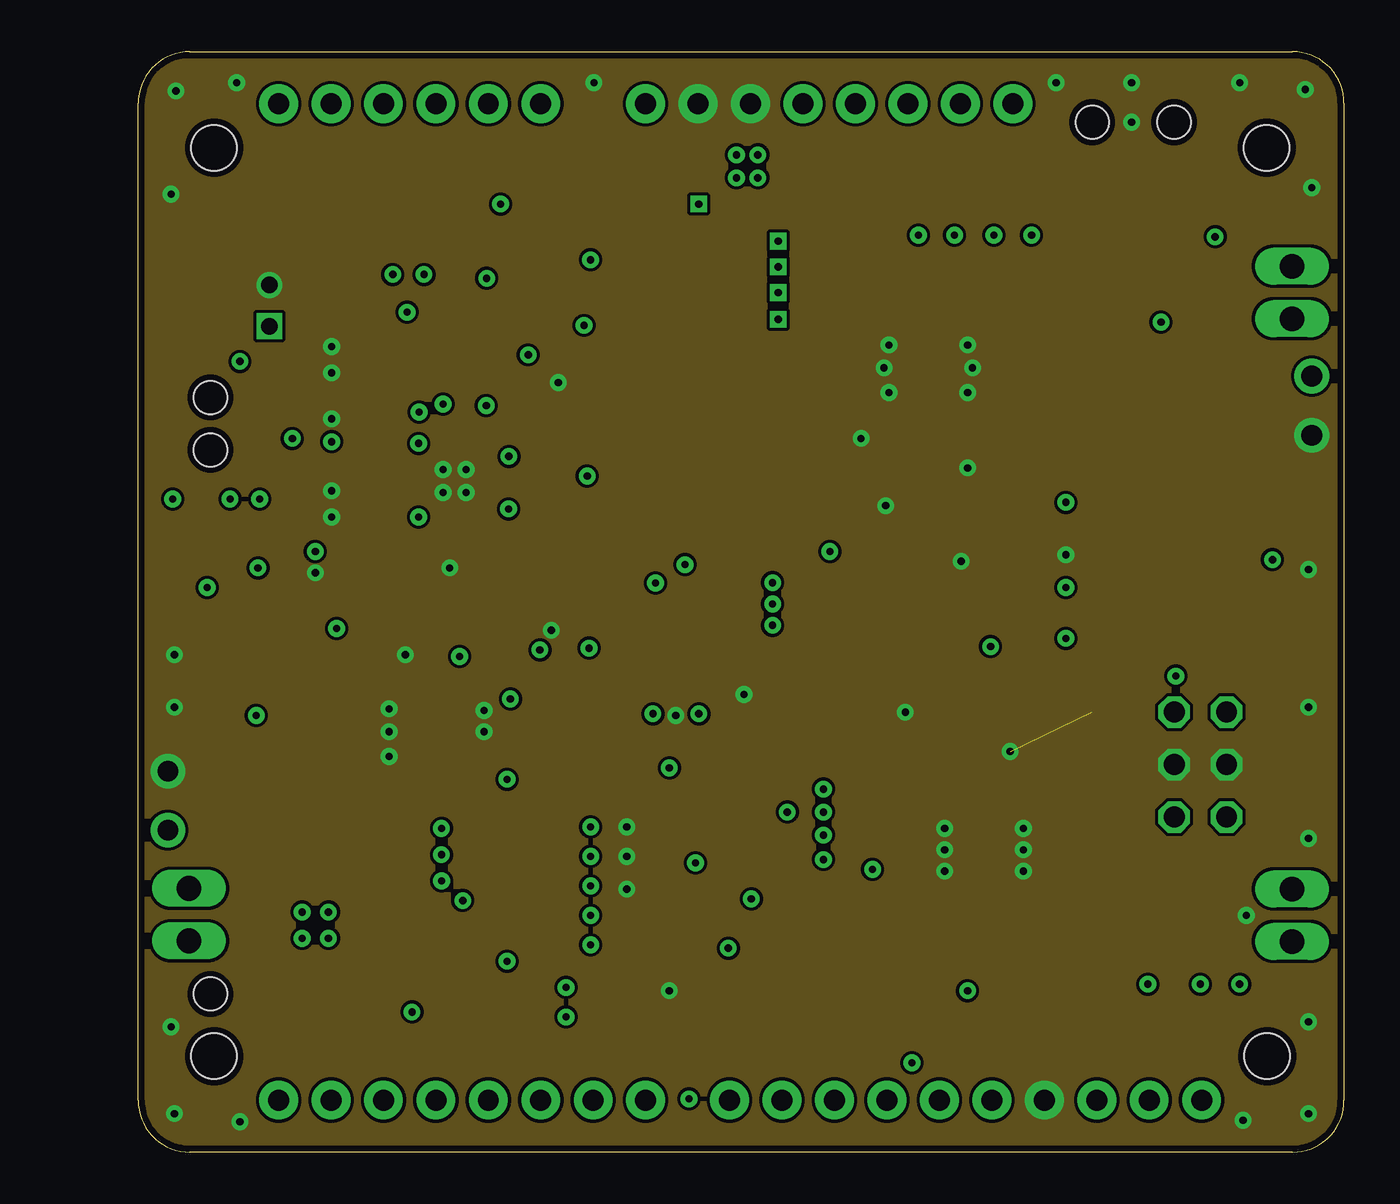
[diagram p7: board, inner layer Route2]
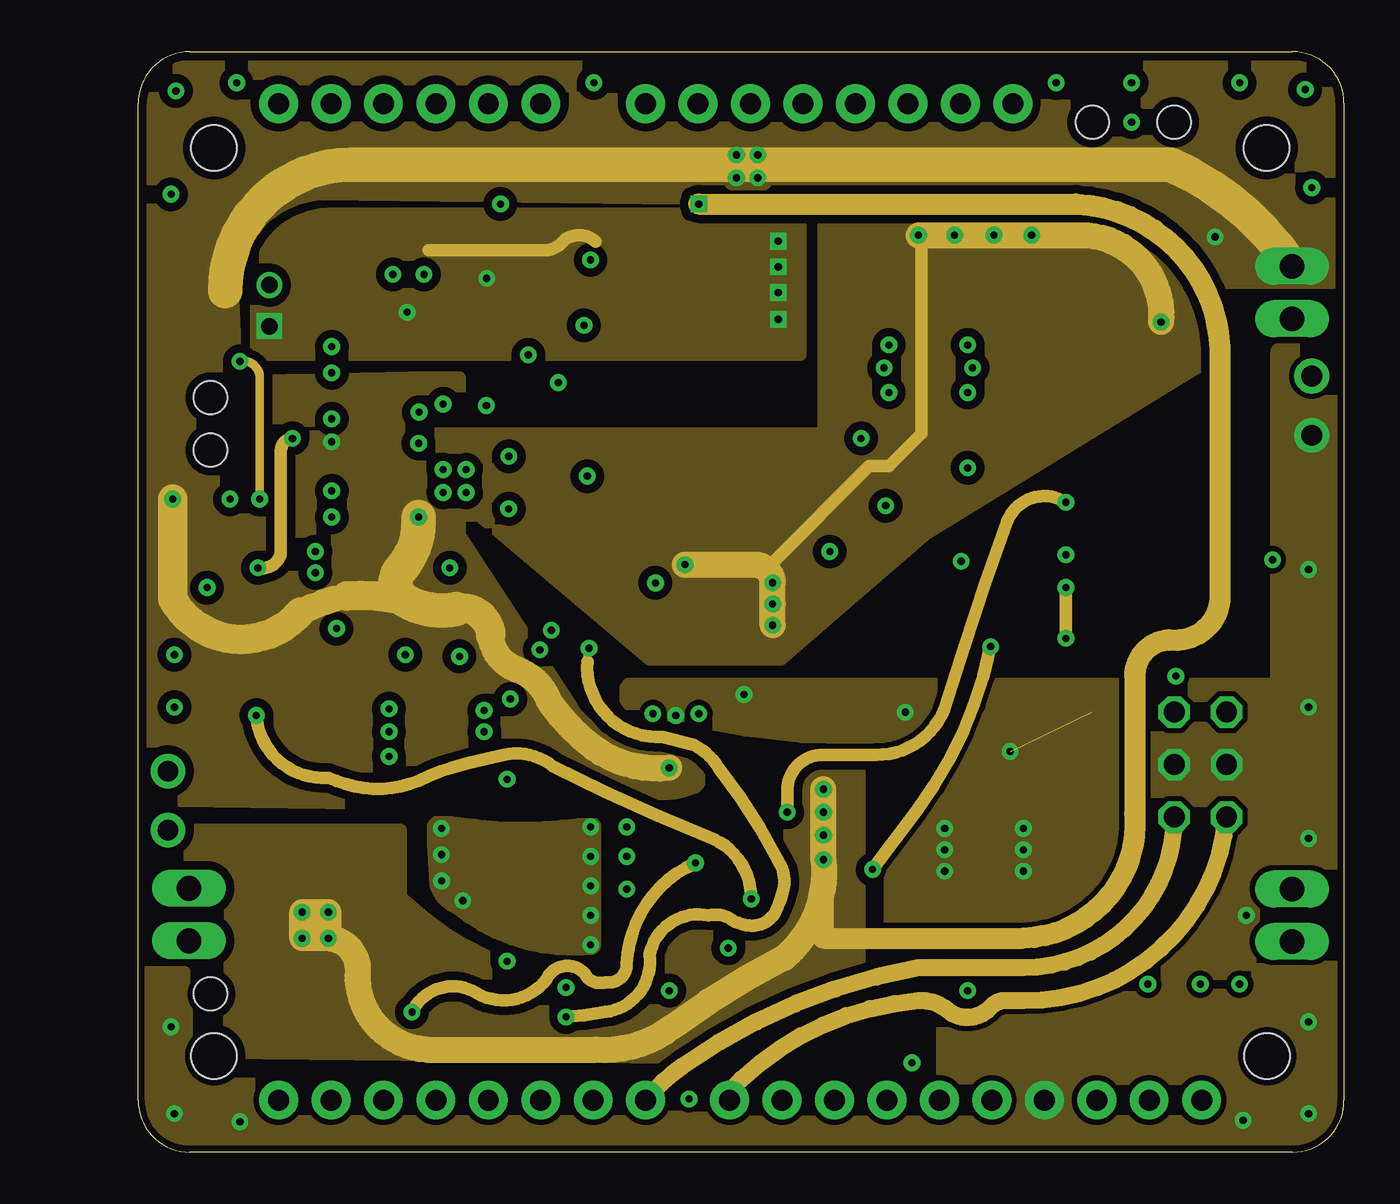
[diagram p8: board, inner layer Route3]
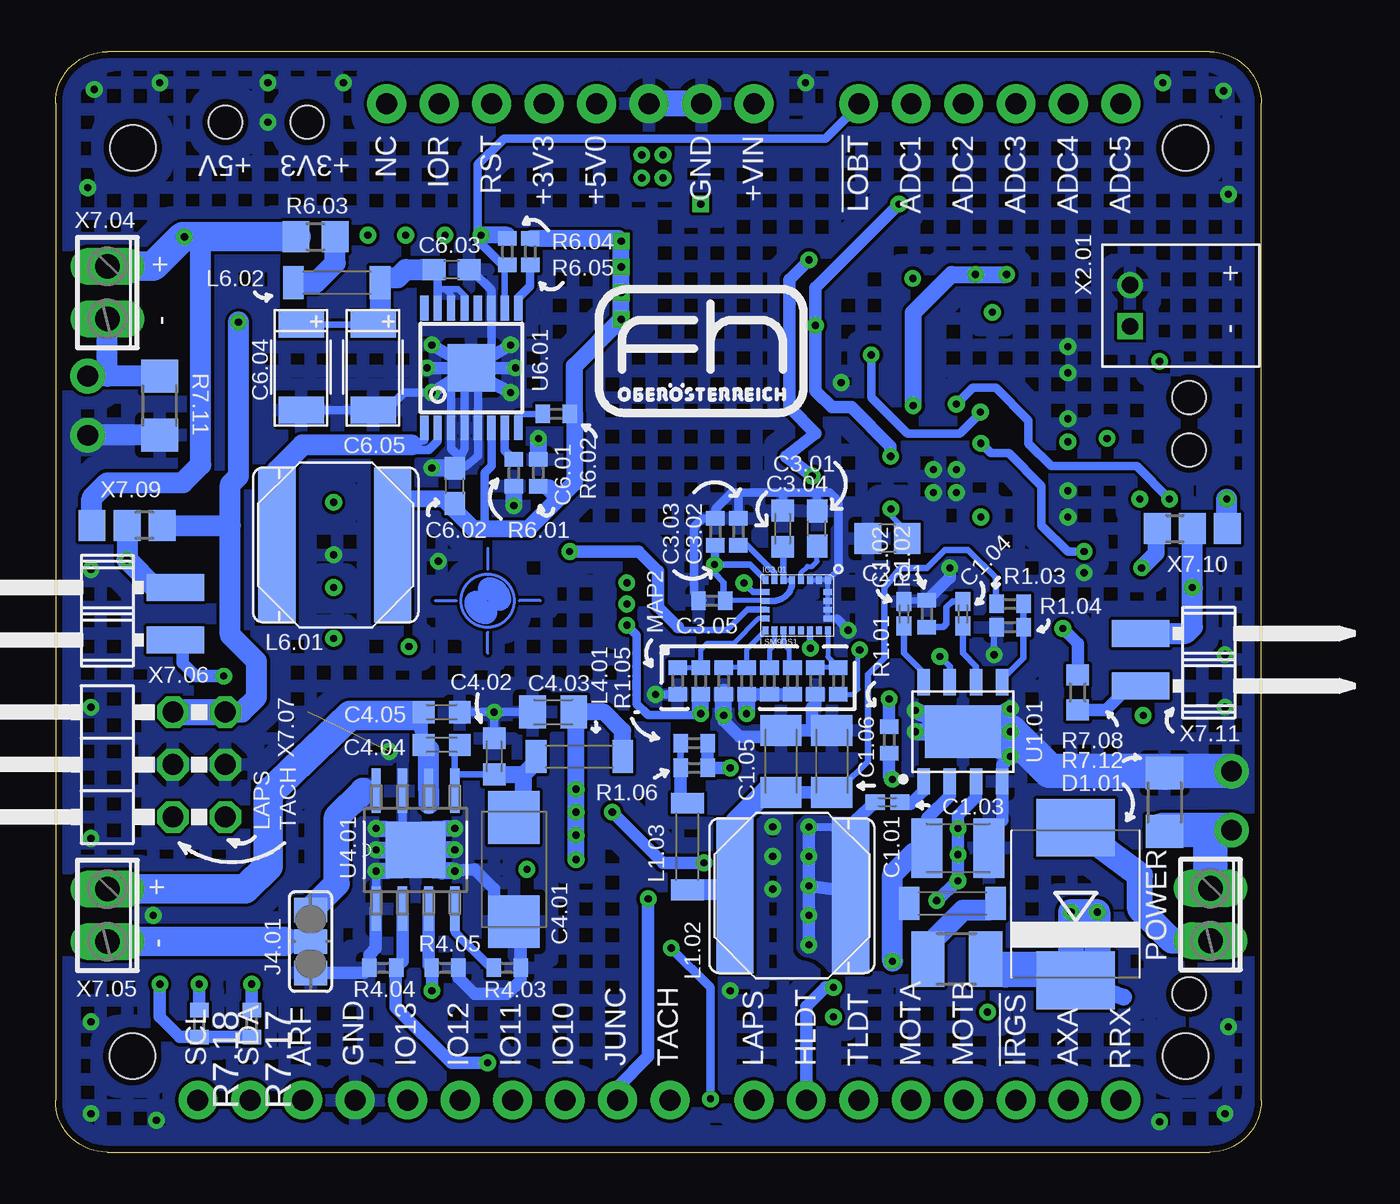
[diagram p9: board, bottom side, seen from below]

Size 58.4 x 53.3 mm. Coordinates in mm from the lower left corner, seen from the top.
Outline: 58.4,50.8 arc90 55.9,53.3 2.5,53.3 arc90 0,50.8 0,2.5 arc90 2.5,0 55.9,0 arc90 58.4,2.5 58.4,50.8
Copper layers (1*2+3*4+5*6+7*16): Top 0.035mm / dielectric 0.2mm / Route2 0.035mm / dielectric 0.15mm / Route3 0.035mm / dielectric 0.2mm / layer 4 0.035mm / dielectric 0.15mm / layer 5 0.035mm / dielectric 0.2mm / layer 6 0.035mm / dielectric 0.15mm / layer 7 0.035mm / dielectric 0.2mm / Bottom 0.035mm
Design rules "default *": minimum track width 6mil, minimum drill 0.25mm, track to track 6mil, track to pad 8mil, pad to pad 8mil, via to via 6mil, smd to smd 8mil, copper to edge 12mil, drill to drill 24mil, minimum pad ring 9mil, minimum via ring 9mil, stop-mask expansion 3mil, vias tented up to drill 0mil, thermal gap 12mil
Holes 2.2 mm at 54.68,4.65 3.68,4.65 54.66,48.64 3.68,48.64
Holes 1.6 mm at 50.17,49.88 46.2,49.88 3.5,36.55 3.5,34.01 3.5,7.66

### Footprints (pad centres in the part's own frame; a part is rotated, then mirrored left to right if it is on the bottom)
C1210K = smd 1.5 x 2.9: 1 -1.5,0; 2 1.5,0
C0402K = smd 0.925 x 0.74: 1 -0.6,0; 2 0.6,0
C1206K = smd 1.5 x 2: 1 -1.5,0; 2 1.5,0
C0805 = smd 1.3 x 1.5: 1 -0.95,0; 2 0.95,0
C0603K = smd 1.05 x 1.08: 1 -0.875,0; 2 0.875,0
C0603 = smd 1.1 x 1: 1 -0.85,0; 2 0.85,0
A/3216-18R = smd 1.95 x 1.5: + 1.375,0; - -1.375,0
C0402 = smd 0.7 x 0.9: 1 -0.65,0; 2 0.65,0
C/6032-28R = smd 2.55 x 2.5: + 2.525,0; - -2.525,0
C0805K = smd 1.3 x 1.6: 1 -1,0; 2 1,0
C-2312 = smd 1.3 x 2.2: N 2.032,0.022; P -2.108,0.022
SMC = smd 2.8 x 3.8: A 3.7,0; C -3.7,0
CHIPLED_1206 = smd 1.5 x 1.5: A 0,-1.75; C 0,1.75
R1210 = smd 1.6 x 2.7: 1 -1.4,0; 2 1.4,0
LGA-24 = smd 0.29 x 0.4: 1 -0.025,2.45; 6 -0.025,0; 7 0.405,0; 8 0.835,0; 9 1.264,0; 10 1.694,0; 11 2.124,0; 12 2.554,0; 13 2.985,0; 18 2.985,2.45; 19 2.554,2.45; 20 2.124,2.45; 21 1.694,2.45; 22 1.264,2.45; 23 0.835,2.45; 24 0.405,2.45 | smd 0.4 x 0.29: 2 -0.025,1.87; 3 -0.025,1.44; 4 -0.025,1.01; 5 -0.025,0.58; 14 2.985,0.58; 15 2.985,1.01; 16 2.985,1.44; 17 2.985,1.87
SJ_2 = smd 1.168 x 1.6: 1 -1.524,0; 2 0,0; 3 1.524,0
L4516C = smd 1 x 1.6: 1 -2.1,0; 2 2.1,0
TAIYO-YUDEN.NRS8030T4R7MJGJ = smd 1.8 x 7.5: 1 -2.54,0; 2 3.06,0
SMD1,27-2,54 = smd 1.27 x 2.54: 1 0,0
SO-08 = smd 0.6 x 2.2: 1 -1.905,-2.6; 2 -0.635,-2.6; 3 0.635,-2.6; 4 1.905,-2.6; 5 1.905,2.6; 6 0.635,2.6; 7 -0.635,2.6; 8 -1.905,2.6
R0402 = smd 0.7 x 0.9: 1 -0.65,0; 2 0.65,0
R0805 = smd 1.3 x 1.5: 1 -0.95,0; 2 0.95,0
R0603 = smd 1 x 1.1: 1 -0.85,0; 2 0.85,0
M0805 = smd 1.3 x 1.6: 1 -0.95,0; 2 0.95,0
SJ = smd 1.168 x 1.6: 1 -0.762,0; 2 0.762,0
R1206 = smd 1.6 x 1.803: 1 -1.422,0; 2 1.422,0
R01005 = smd 0.2 x 0.25: 1 -0.163,0; 2 0.163,0
TP07R = smd 0.7 x 0.7: TP 0,0
SOIC-8-PAD = smd 1.27 x 0.6: 1 -2.4,1.905; 2 -2.4,0.635; 3 -2.4,-0.635; 4 -2.4,-1.905; 5 2.4,-1.905; 6 2.4,-0.635; 7 2.4,0.635; 8 2.4,1.905 | smd 2.55 x 3.7: PAD 0,0
VQFN-24 = smd 0.6 x 0.23: 1 -1.5,1; 2 -1.5,0.6; 3 -1.5,0.2; 4 -1.5,-0.2; 5 -1.5,-0.6; 6 -1.5,-1; 13 1.5,-1; 14 1.5,-0.6; 15 1.5,-0.2; 16 1.5,0.2; 17 1.5,0.6; 18 1.5,1 | smd 0.23 x 0.6: 7 -1,-1.5; 8 -0.6,-1.5; 9 -0.2,-1.5; 10 0.2,-1.5; 11 0.6,-1.5; 12 1,-1.5; 19 1,1.5; 20 0.6,1.5; 21 0.2,1.5; 22 -0.2,1.5; 23 -0.6,1.5; 24 -1,1.5 | smd 1.27 x 1.27: PAD 0,0
HSOP8 = smd 2.15 x 0.45: 1 -2.857,1.905; 2 -2.857,0.635; 3 -2.857,-0.635; 4 -2.857,-1.905; 5 2.857,-1.905; 6 2.857,-0.635; 7 2.857,0.635; 8 2.857,1.905 | smd 2.7 x 2.9: THERMAL 0,0
R-PDSO-G16 = smd 0.4 x 1.2: 1 -2.275,-2.9; 2 -1.625,-2.9; 3 -0.975,-2.9; 4 -0.325,-2.9; 5 0.325,-2.9; 6 0.975,-2.9; 7 1.625,-2.9; 8 2.275,-2.9; 9 2.275,2.9; 10 1.625,2.9; 11 0.975,2.9; 12 0.325,2.9; 13 -0.325,2.9; 14 -0.975,2.9; 15 -1.625,2.9; 16 -2.275,2.9 | smd 2.31 x 2.31: PAD 0,0
SC70-6 = smd 0.35 x 0.8: 1 -0.65,-0.95; 2 0,-0.95; 3 0.65,-0.95; 4 0.65,0.95; 5 0,0.95; 6 -0.65,0.95
JST_S2B-PH-K-S(LF)(SN) = drill 0.8 square: 1 1,0 | drill 0.8: 2 -1,0
2POL254 = drill 1.2 long: 1 -1.27,0; 2 1.27,0
AU_PINS = drill 1.016 pad 1.88: 3.3V -8.89,-24.13; 5V -6.35,-24.13; ADC.0 6.35,-24.13; ADC.1 8.89,-24.13; ADC.2 11.43,-24.13; ADC.3 13.97,-24.13; ADC.4 16.51,-24.13; ADC.5 19.05,-24.13; AREF -20.574,24.13; GND2 -1.27,-24.13; GND3 -3.81,-24.13; GND.1 -18.034,24.13; I/OREF -13.97,-24.13; IO.0 19.05,24.13; IO.1 16.51,24.13; IO.2 13.97,24.13; IO.3 11.43,24.13; IO.4 8.89,24.13; IO.5 6.35,24.13; IO.6 3.81,24.13; IO.7 1.27,24.13; IO.8 -2.794,24.13; IO.9 -5.334,24.13; IO.10 -7.874,24.13; IO.11 -10.414,24.13; IO.12 -12.954,24.13; IO.13 -15.494,24.13; N/C -16.51,-24.13; RESET -11.43,-24.13; SCL -25.654,24.13; SDA -23.114,24.13; VIN 1.27,-24.13
M1X2_MALE_RIGHT_ANGLED_SMD = smd 1.3 x 2.8: 1 -1.27,-0.76; 2 1.27,-0.76
2X03/90 = drill 1.016 octagon: 1 -2.54,-6.35; 2 -2.54,-3.81; 3 0,-6.35; 4 0,-3.81; 5 2.54,-6.35; 6 2.54,-3.81
A0R-JMP = smd 1.5 x 1.3: 1 0,1.7; 2 0,0; 3 0,-1.7

### Placement (x,y rotation side)
C1.01  14.69,14.72 0 bottom
C1.02  17.31,26.07 90 bottom
C1.03  18.11,16.94 180 bottom
C1.04  14.45,26.07 90 bottom
C1.05  23.26,18.93 90 bottom
C1.06  20.8,18.93 90 bottom
C2.01  18.1,29.72 180 bottom
C2.02  20.19,33.46 90 top
C2.03  20.43,30.92 180 top
C2.04  16.54,39.33 90 top
C2.05  14.64,39.33 270 top
C3.01  21.52,30.2 90 bottom
C3.02  25.33,30.04 90 bottom
C3.03  26.44,30.04 90 bottom
C3.04  23.18,30.2 90 bottom
C3.05  26.61,26.71 180 bottom
C4.01  36.2,13.69 90 bottom
C4.02  37.16,19.17 90 bottom
C4.03  34.3,21.31 180 bottom
C4.04  39.7,19.72 180 bottom
C4.05  39.7,21.31 0 bottom
C6.01  35.01,32.9 90 bottom
C6.02  39.06,32.26 90 bottom
C6.03  39.22,42.74 0 bottom
C6.04  46.52,37.98 270 bottom
C6.05  43.03,37.98 270 bottom
D1.01  8.99,12.01 90 bottom
D7.03  3.5,34.01 90 top
D7.04  3.5,36.55 90 top
D7.05  50.17,49.88 0 top
D7.06  46.2,49.88 0 top
D7.07  3.5,7.66 90 top
DCL1  46.68,35.28 90 top
DCL2  79.2,9.73 0 top  (outside the outline)
F1.01  14.75,9.35 180 bottom
IC3.01  23.99,25.26 0 bottom
J4.01  46.04,10.2 90 bottom
L1.01  14.96,12.04 180 bottom
L1.02  22.95,12.42 0 bottom
L1.03  27.79,14.8 90 bottom
L2.01  26.37,34.55 270 top
L2.02  14.45,44.09 0 top
L4.01  33.03,19.17 0 bottom
L6.01  44.62,29.41 180 bottom
L6.02  44.77,42.11 180 bottom
NTC+  3.5,42.58 90 top
NTC-  3.5,40.04 270 top
PAD1  46.2,18.77 90 top
PAD2  46.2,16.23 90 top
PAD3  46.2,21.31 90 top
Q2.01  26.54,42.22 270 top
R1.01  18.03,19.96 90 bottom
R1.02  16.2,26.07 270 bottom
R1.03  12.17,26.55 180 bottom
R1.04  12.17,25.42 0 bottom
R1.05  27.47,19.8 180 bottom
R1.06  27.47,18.61 0 bottom
R2.01  10.99,35.52 0 top
R2.02  10.99,34.41 180 top
R2.03  10.99,39.02 0 top
R2.04  20.67,43.94 90 top
R2.05  20.19,39.33 270 top
R2.07  18.13,43.94 90 top
R2.08  19.4,43.94 270 top
R2.10  10.99,29.49 180 top
R2.11  10.99,30.76 0 top
R2.12  10.99,33.3 180 top
R2.13  10.99,32.03 0 top
R2.14  10.99,36.63 180 top
R2.15  10.98,37.77 0 top
R3.01  20.49,22.82 270 bottom
R3.02  21.6,22.82 90 bottom
R3.03  27.15,22.82 270 bottom
R3.04  28.27,22.82 90 bottom
R3.05  24.93,22.82 270 bottom
R3.06  26.04,22.82 90 bottom
R3.07  23.82,22.82 270 bottom
R3.08  22.71,22.82 270 bottom
R4.03  36.52,8.93 180 bottom
R4.04  42.55,8.93 0 bottom
R4.05  39.54,8.93 180 bottom
R6.01  36.2,32.9 90 bottom
R6.02  34.14,35.76 180 bottom
R6.03  45.81,44.33 0 bottom
R6.04  36.52,43.61 90 bottom
R6.05  35.41,43.61 90 bottom
R7.01  7.47,36.71 270 top
R7.02  8.42,8.45 0 top
R7.03  8.58,13.69 180 top
R7.04  10.17,19.88 270 top
R7.05  34.69,47.19 90 top
R7.06  32.23,47.11 90 top
R7.07  24.61,47.11 90 top
R7.08  8.9,22.26 270 bottom
R7.09  44.93,23.77 0 top
R7.10  44.93,25.99 0 top
R7.11  53.35,36.15 270 bottom
R7.12  4.69,16.94 90 bottom
R7.13  50.17,46.39 180 top
R7.14  46.36,46.39 180 top
R7.15  6.68,5.59 0 top
R7.16  7.47,32.5 90 top
R7.17  48.9,6.23 270 bottom
R7.18  51.44,6.23 270 bottom
R7.19  48.9,6.07 270 top
R7.20  51.44,6.07 270 top
R213  17.94,32.74 0 top
REF2  32.07,34.8 0 bottom
TP1  -5.32,31.03 0 top  (outside the outline)
TP2  -3.49,33.65 0 top  (outside the outline)
U1.01  14.45,20.36 90 bottom
U2.0  15.33,32.5 180 top
U4.01  40.96,14.64 90 bottom
U6.01  38.27,37.98 0 bottom
U7.01  10.17,23.45 90 top
U7.2  44.93,30.12 90 top
U7.03  6.28,29.88 90 top
U$3  [A4L-LOC]  -93.66,-63.15 0 top  (outside the outline)
U$5  [PASS-ROUND]  37.47,26.71 0 bottom
U$8  [PASSER-CIRCLE]  79.11,25.25 0 top  (outside the outline)
X2.01  6.36,40.99 270 bottom
X7.01  2.46,11.51 270 bottom
X7.02  25.85,26.65 180 top
X7.03  53.35,26.07 270 top
X7.04  55.89,41.63 270 bottom
X7.05  55.89,11.47 270 bottom
X7.06  53.35,26.07 90 bottom
X7.07  56.52,18.77 90 bottom
X7.08  5.09,23.85 90 top
X7.09  54.93,30.36 270 bottom
X7.10  3.34,30.2 90 bottom
X7.11  5.09,23.85 270 bottom

### Tracks (layer width: path | path; a pad name or v marks a point on that pad's centre or on a via)
!IRQ_GYRO  (via drill 0.35)
  Top 0.61: v20.72,6.55 15.41,6.55 11.91,3.21 11.91,2.55 X7.02.IO.2
  Route3 0.406: v21.84,24.41 21.76,24.48 21.76,23.77
  Route3 0.61: 21.76,23.77 arc98 25.41,20.12 26.92,19.72 arc-31 28.11,18.61 arc-11 30.96,14.17 arc-55 31.2,12.58 arc-14 30.96,11.86 arc-84 29.46,10.99 arc-3 28.9,11.15 arc53 27.63,11.47 arc90 24.77,9.56 arc-90 22.63,6.78 21.6,6.63 v20.72,6.55
  Bottom 0.305: IC3.01.11 21.86,24.43 v21.84,24.41
+3V3  (via drill 0.35)
  Top 0.406: 18.9,22.98 18.9,23.06 18.42,23.53 18.66,23.53 v19.45,24.33
  Top 0.61: R7.01.2 arc-90 7.47,35.7 v7.47,34.57 R7.16.2 | R7.14.2 45.41,46.39 | v53.34,8.13 52.39,9.09 52.39,13.05 54.45,15.12 54.45,19.57 X7.07.6
  Top 0.813: v24.93,21.23 24.93,22.74 24.77,22.98
  Top 1.016: v5.8,28.3 7.23,26.87 12.71,26.87 14.3,25.28 16.6,25.28 18.9,22.98 24.77,22.98 28.27,22.98 30.73,25.44 v30.73,25.52 v30.73,26.55 v30.73,27.58 | R7.05.1 36.07,45.04 v37.79,44.41 v39.54,44.41 v41.44,44.41 v43.27,44.41 44.32,45.2 R7.14.2
  Route3 0.61: v5.8,28.3 arc90 6.91,29.01 6.91,33.93 arc-90 v7.47,34.57 | v37.79,44.41 37.94,44.41 37.94,34.8 36.36,33.22 35.4,33.22 30.73,28.54 v30.73,27.58
  Route3 1.27: v30.73,25.52 v30.73,26.55 v30.73,27.58 arc90 29.85,28.45 v26.48,28.45 | v37.79,44.41 v39.54,44.41 v41.44,44.41 v43.27,44.41 45.97,44.41 arc-90 v49.54,40.2
  Bottom 0.254: C3.04.1 23.18,28.94 | 23.15,28.01 IC3.01.23 IC3.01.22 | IC3.01.3 arc-90 24.02,26.71 C3.05.1 | R3.01.2 19.79,22.17 19.53,22.42 19.53,24.17 v19.45,24.33
  Bottom 0.305: 23.15,28.01 23.15,29.07 arc-90 C3.04.1 | IC3.01.3 23.65,26.7 arc-90 22.72,27.62 IC3.01.22 | IC3.01.1 24.76,28.45 v26.48,28.45 26.48,28.04 26.04,27.6 26.04,26.72 C3.05.1
  Bottom 0.406: R3.03.2 27.15,21.24 | v27.15,21.23 27.15,21.16 29.7,21.16 30.25,21.71 30.25,25.04 v30.73,25.52 | 24.93,22.1 R3.05.2 | v26.48,28.45 C3.03.1
  Bottom 0.61: R6.04.2 36.52,44.41 | 27.15,22.02 R3.03.2 | R3.05.2 R3.07.2 R3.08.2 | 5.09,30.15 arc90 X7.10.1 | 25.88,26.72 C3.05.1 | v53.34,8.13 53.34,6.55 52.38,5.58 R7.18.2 R7.17.2
  Bottom 0.813: 36.52,44.41 v37.79,44.41 | v27.15,21.23 27.15,21.24 27.15,22.02 | v5.8,28.3 5.09,29.01 5.09,30.15 X7.10.1 | 24.93,22.1 v24.93,21.23
  Bottom 1.016: X7.07.5 49.38,21.31 48.66,22.02 48.66,23.77 49.93,25.04 49.93,30.36 | 49.93,30.36 49.93,32.34 49.54,32.74 v49.54,40.2 | X7.09.1 49.93,30.36
  Bottom 1.27: X7.07.6 X7.07.5
  pour Route3 (isolate 0.406): 38.11,29.88 51.28,37.98 51.28,45.6 33.18,45.6 33.19,34.8 12.87,34.8 13.02,30.84 16.52,30.84 24.77,23.85 31.12,23.85
+4.1V  (via drill 0.35)
  Top 0.254: R2.14.2 8.68,36.63 8.6,36.71 | 8.6,36.71 8.6,38.19 8.18,38.61 6.83,38.61 6.36,39.09 X2.01.1 | 8.6,36.71 8.6,33.3 | 8.6,33.3 R2.12.2 | R2.10.2 9.4,29.49 8.6,30.28 8.6,33.3 | U2.0.9 15.53,36.51 14.69,37.34 14.69,37.9 C2.05.+ 15.93,36.67 U2.0.8
  Top 0.305: 29.21,42.89 28.98,42.89 arc180 Q2.01.7 | 29.21,44.01 28.98,44.01 Q2.01.8 28.98,44.13 | Q2.01.6 28.98,41.62 29.21,41.6
  Top 0.61: C2.05.+ 14.58,37.9 14,37.9 13.05,38.86 13.05,40.28 | 29.21,40.32 Q2.01.5 29.02,40.3 | 6.41,40.04 6.64,40.28 13.05,40.28 | 13.05,40.28 13.05,40.68 v13.02,40.68 | 18.15,43.2 18.18,43.23 R2.07.1 17.16,42.32 v16.88,42.32
  Top 0.813: X2.01.1 6.41,40.04 | Q2.01.5 29,40.34 v31,40.34 | 28.98,41.62 28.99,41.63 v31,41.63 | Q2.01.7 29,42.88 v31,42.88 | 28.98,44.01 29.1,44.12 v31,44.12
  Route3 0.61: 14.06,43.69 19.85,43.69 arc44 20.65,44.17 arc-81 22.15,44.09
  Bottom 0.305: 39.62,31.63 C6.02.1 | 42.08,31.63 L6.01.1 | U6.01.6 37.31,35.08 | 35.65,44.25 R6.05.2
  Bottom 0.406: R6.05.2 35.58,44.17 35.33,44.25 | 37.63,30.2 37.63,32.9 37.29,33.24 U6.01.6 | 34.52,32.17 34.93,32.17 C6.01.1 | R6.02.1 33.35,35.76 33.27,35.84
  Bottom 0.813: 42.08,31.63 39.62,31.63 38.19,30.2 37.63,30.2 35.49,30.2 34.02,31.67 | 34.02,31.67 33.27,32.42 33.27,35.84 33.27,38.07 v31,40.34 v31,41.63 v31,42.88 v31,44.12 31.13,44.25 35.33,44.25 | 34.52,32.17 34.02,31.67
  pour Top (no thermals): 15.49,34.64 15.49,36.79 15.01,37.26 15.25,37.5 15.96,36.79 15.96,34.64
  pour Route3 (isolate 0.406, no thermals): 32.07,38.61 5.72,38.61 5.72,41.79 arc-90 9.22,45.44 32.07,45.44
+5V  (via drill 0.35)
  Top 0.254: R2.02.2 v9.37,34.41 | U2.0.18 13.58,31.5 v13.58,30.76 14.33,30.76 U2.0.19
  Top 0.406: 29.61,47.9 v30.01,48.3
  Top 0.61: R7.13.2 49.32,45.54 49.3,45.52 50.49,44.33 v52.16,44.33
  Top 0.813: v28.98,47.19 v28.98,48.3 v30.01,48.3 30.01,47.5 29.69,47.5 v28.98,47.19 | v30.01,47.19 v28.98,47.19
  Top 1.016: 29.46,47.82 29.93,47.27 30.49,46.71 32.19,46.39 R7.06.1 32.23,46.07
  Route3 0.305: v25.73,18.61 25.57,18.61
  Route3 0.406: 29.54,47.82 v30.01,48.3 v28.98,48.3
  Route3 1.27: v25.73,18.61 arc-42 22.07,19.56 arc-17 19.93,21.79 arc51 18.34,23.37 arc-67 17.07,25.04 | 7.87,26.15 arc-15 10.09,26.95
  Route3 1.422: 15.41,26.31 arc-99 17.07,25.04 | v1.67,31.63 1.67,26.79 arc110 7.87,26.15 | 10.09,26.95 arc-17 12.95,26.71
  Route3 1.676: X7.04.1 arc33 50.01,47.82 29.54,47.82 10.33,47.82 arc90 4.21,41.71 | v13.58,30.76 13.58,30.52 arc-42 12.71,28.22 arc101 12.95,26.71 arc43 15.41,26.31
  Bottom 0.305: 51.05,44.25 51.05,44.17 51.05,44.09
  Bottom 0.406: v52.16,44.33 51.13,44.25 51.05,44.17
  Bottom 0.61: v25.73,18.61 R1.06.2 R1.05.1 | 51.36,43.85 v52.16,44.33
  Bottom 1.016: X7.09.3 56.63,31.67 55.89,32.42 52.24,32.42 51.36,33.3 51.36,43.85 | X7.10.3 1.67,30.36 v1.67,31.63
  Bottom 1.422: X7.04.1 53.66,42.9 52.24,44.33 v52.16,44.33 R6.03.1
  pour Route3: 30.57,48.3 arc90 30.09,48.77 28.98,48.77 arc90 28.5,48.3 28.5,47.19 arc90 28.98,46.71 30.09,46.71 arc90 30.57,47.19
  pour Top: 30.57,48.3 30.57,47.11 arc-90 30.17,46.71 28.98,46.71 arc-90 28.5,47.19 28.5,48.3 arc-90 28.98,48.77 30.09,48.77 arc-90
  pour Route3 (isolate 0.406, no thermals): 58.11,50.84 58.11,42.11 47.95,42.11 47.95,45.92 8.74,46.39 arc90 4.61,41.31 4.77,37.34 13.18,37.5 15.56,37.5 15.56,29.88 20.96,21.63 arc53 23.5,20.04 26.68,19.72 26.99,19.56 arc-90 26.99,17.66 arc-43 22.23,17.82 arc20 20.65,17.5 14.3,17.5 arc53 13.34,17.18 arc-53 12.71,16.87 0.01,17.02 0.01,50.84 arc-90 2.39,53.22 55.73,53.22 arc-90
+12V  (via drill 0.35)
  Top 0.61: R7.15.2 7.52,7.45 R7.02.1 7.47,10.04 v7.95,10.36
  Top 1.27: v33.19,17.58 v33.19,14.17 | R7.07.1 26.72,46.34 v27.15,45.92
  Route3 1.016: v27.15,45.92 45.41,45.92 arc-90 52.39,38.3 52.39,26.71 arc-90 50.01,24.8 arc90 48.26,23.06 48.26,16.39 arc-93 42.87,10.36 33.18,10.36 33.19,10.67 v33.19,14.17
  Route3 1.27: v33.19,17.58 v33.19,14.17 arc-56 31.28,9.4 arc10 25.88,6.07 arc-42 22.15,4.96 13.98,4.96 arc-90 10.64,8.77 arc90 v9.22,10.36 | v9.22,10.36 v9.22,11.63 v7.95,11.63 v7.95,10.36 v9.22,10.36
  Bottom 0.406: 8.74,8.29 D1.01.C
  Bottom 0.813: D1.01.C 6.68,7.52 | 33.27,21.28 C4.03.1 | v33.19,14.17 v33.19,15.36 v33.19,16.47 v33.19,17.58 33.19,21.2 arc-90 C4.03.1 | L4.01.2 30.93,20.4 31.84,21.31 C4.03.1
  Bottom 1.016: F1.01.1 12.45,9.09 12.39,9.09 12.39,8.61 | 8.74,8.29 8.74,7.66
  Bottom 1.27: 8.74,8.29 9.06,8.61 9.22,8.61 | 9.22,8.61 12.39,8.61 | 12.39,9.09 10.17,9.09 | 9.22,8.61 v9.22,11.63 v7.95,11.63 7.95,8.61 | 9.22,8.61 9.22,8.45
  pour Route3 (isolate 0.406, no thermals): 0.01,15.59 0.01,9.88 3.82,9.88 3.82,4.8 34.93,4.48 34.93,18.77 32.07,18.77 arc90 30.17,17.18 arc-67 29.22,15.91 23.5,15.91 23.5,8.93 arc-90 22.55,8.29 arc-44 13.02,12.1 12.71,12.42 12.71,15.59
CAR.AUXILLARY  (via drill 0.35)
  Top 0.406: v44.93,31.47 44.93,30.36 45.17,30.12 U7.2.2
  Top 0.61: X7.02.IO.1 9.34,2.7 v13.26,6.78
  Route3 0.61: v13.26,6.78 arc-90 16.2,7.82 arc88 19.77,8.37 arc-126 21.76,8.45 arc57 22.63,8.21 22.79,8.21 arc90 23.66,9.09 arc-64 v26.99,14.01 | v31.44,16.47 31.43,17.5 arc-90 33.18,19.25 35.72,19.25 arc70 39.05,21.47 arc-3 42.07,30.52 arc-101 v44.93,31.47
  Bottom 0.61: v26.99,14.01 28.98,14.01 v31.44,16.47
CAR.BLIGHT  (via drill 0.35)
  Top 0.406: X7.02.IO.5 19.5,1.82 20.33,0.99 25.41,0.99 v26.68,2.58 | U7.2.5 42.08,30.12 41.28,29.33 v41.28,24.48
  Top 0.61: v35.57,13.69 31.76,9.88 v28.58,9.88
  Route3 0.61: v35.57,13.69 37.71,16.55 arc25 v41.28,24.48
  Bottom 0.406: v26.68,2.58 26.68,7.97 v28.58,9.88
CAR.FLIGHT  (via drill 0.35)
  Top 0.305: 12.07,23.37 11.99,23.45 U7.01.2
  Top 0.61: v20.72,7.97 16.84,7.97 11.76,13.21 11.76,17.34 13.18,18.77 13.18,22.1 12.07,23.37
  Bottom 0.61: v20.72,7.97 21.12,7.97 22.04,7.06 X7.02.IO.6
  pour Top (no thermals): 12.07,23.53 12.07,23.21 11.91,23.37 11.6,23.37 11.52,23.53
CAR.GATECTLR  (via drill 0.35)
  Top 0.406: v5.72,21.15 7.07,21.15 7.79,21.87 7.79,22.98 8.26,23.45 U7.01.5
  Route3 0.61: v5.72,21.15 arc90 9.22,18.13 9.61,17.98 arc44 13.58,17.98 arc-12 15.17,18.61 arc-4 17.71,19.25 arc-51 20.09,18.69 arc6 27.63,15.28 arc-69 v29.69,12.26
  Bottom 0.61: X7.02.IO.9 31.18,3.15 29.69,4.64 v29.69,12.26
CAR.LAPCNT
  Route3 0.813: X7.07.1 arc-90 42.87,8.93 37.79,8.93 arc25 26.36,4.16 arc17 X7.02.IO.7
CAR.SPEED
  Route3 0.813: X7.02.IO.8 28.58,2.89 29.22,3.53 arc-39 37.79,7.34 arc-43 39.22,6.86 arc86 41.28,7.02 arc-44 41.92,7.34 42.87,7.34 arc86 X7.07.2
GND  (via drill 0.35, 0.35 pad 0.6, 1 pad 1.68)  (1 unrouted)
  Top 0.254: 15.55,32.35 U2.0.PAD | R2.15.1 10.33,39.01 R2.03.1 v9.37,39.01 | 10.48,37.77 R2.15.1 | R2.15.1 10.33,37.74 v9.37,37.74 | R2.13.1 10.41,31.95 | R2.11.1 v9.37,30.76 | 10.41,31.95 10.41,30.76 | 10.41,31.95 10.41,32.03 v9.37,32.03 | 14.75,31 U2.0.20 14.73,31.9 v14.77,31.95 | U2.0.22 15.53,32.3 U2.0.PAD | v14.77,31.95 14.93,32.1 | 14.93,32.1 15.09,32.26 | 14.93,32.1 15.13,32.1 U2.0.21 | U2.0.PAD 15.13,32.5 15.13,32.3 v14.77,31.95 | R2.01.1 v9.38,35.52 v9.37,35.52 | R213.2 18.74,32.74 20.33,34.33 C2.02.2
  Top 0.305: U7.03.4 5.79,30.53 6.28,30.04 6.28,29.56 6.6,29.25 7.21,29.25 U7.03.1 7.47,28.99 7.47,28.61 8.02,28.06 v8.58,28.06 | v12.15,21.47 11.76,21.63 11.76,22.58 11.53,22.8 U7.01.1 10.42,22.8 10.17,23.06 10.17,23.85 9.91,24.1 U7.01.4
  Top 0.406: C2.05.- 15.06,40.28 C2.04.2 | NTC-.1 3.98,40.04 5.93,41.99 X2.01.2 | U7.2.1 45.47,29.47 v44.93,28.93 | U7.2.4 41.22,30.77 39.85,29.41 v39.85,28.61 | v20.35,37.27 20.19,37.43 R2.05.2
  Top 0.61: D7.06.C 48.11,51.63 | 48.11,51.63 D7.05.C | v48.11,49.88 48.11,51.63 | v1.59,6.07 1.59,7.18 D7.07.C | R7.03.2 7.63,15.43 4.61,18.45 v1.44,18.45
  Bottom 0.254: IC3.01.20 IC3.01.19 IC3.01.18 IC3.01.17 IC3.01.16 IC3.01.15 IC3.01.14
  Bottom 0.305: C1.02.2 16.99,26.72 R1.02.1 16.19,26.72 | R1.04.1 12.95,25.29 v12.95,24.09 | 20.49,28.22 IC3.01.18 | 20.57,25.83 20.57,25.84 IC3.01.14
  Bottom 0.406: C6.01.2 35.01,33.77 | C6.02.2 38.8,33.64 | 38.8,33.64 38.59,34.06 U6.01.4 38.59,37.98 U6.01.PAD | U6.01.5 37.94,37.98 37.95,37.98 | 37.95,37.98 U6.01.PAD | 38.11,37.9 38.03,37.9 37.95,37.98 | U6.01.PAD 37.29,38 U6.01.11 37.29,41.74 38.29,42.74 C6.03.2 | 37.63,38.85 37.63,37.98 U6.01.PAD | 38.58,37.82 38.58,37.98 38.9,37.98 38.9,38.53 arc90 38.58,38.85 | v40.17,36.79 41.52,36.79 42.31,35.99 C6.05.N C6.04.N | C4.03.2 v37.16,21.31 | v37.16,21.31 C4.05.2 | C4.02.2 v37.16,21.31 | U4.01.7 41.6,15.28 | U4.01.1 v42.87,13.61 | v20.01,25.28 20.57,25.83 | 37.94,34.71 37.94,33.7 38.5,33.22 40.17,33.22 | 36.2,31.95 R6.01.1 | 39.24,37.05 U6.01.3 39.24,34.09 38.8,33.64 | R3.04.1 29.09,22.17 v29.34,22.16 | 25.33,31.95 25.65,31.95 26.44,31.15 C3.03.2 26.45,30.68 27.07,30.68 27.47,30.28 27.47,27.1 27.07,26.71 C3.05.2 | 25.33,31.95 23.18,31.95 | 23.18,31.95 C3.04.2 | C3.02.2 25.33,31.95 | C3.01.2 21.52,31.95 | 21.52,31.95 23.18,31.95 | 20.49,28.22 20.49,31.55 20.88,31.95 21.52,31.95
  Bottom 0.61: C1.01.2 13.18,15.23 12.98,15.71 12.55,16.07 U1.01.4 12.55,18.75 12.23,19.09 12.07,19.25 12.55,19.33 | 13.18,19.72 13.76,20.01 U1.01.PAD | 21.36,20.43 21.76,20.43 | 21.76,20.43 C1.05.2 | C1.05.2 23.19,20.59 23.23,20.63 22.91,20.63 C1.05.2 | 26.04,22.26 R3.06.1 | 13.18,19.48 13.23,19.48 | v26.04,21.15 26.04,20.91 25.25,20.12 23.34,20.12 C1.05.2 | 39.7,13.61 38.11,13.69 37.16,12.74 37.16,12.12 C4.01.- arc90 35.87,10.83 R4.03.1 35.88,8.91 35.88,8.29 36.52,7.66 38.11,7.66 38.89,8.44 R4.05.1 | v40.41,37.98 38.59,37.98 | v36.12,37.98 37.63,37.98 | v36.36,39.09 U6.01.PAD | v40.17,39.09 U6.01.PAD | v40.17,36.79 U6.01.PAD | 41.6,15.28 41.35,15.53 41.35,15.6 | 42.88,11.78 42.88,9.86 43.19,9.56 43.19,8.94 R4.04.1 43.46,8.67 J4.01.1 | v15.09,28.3 15.09,27.83 R1.02.1 | R3.02.1 21.6,21.71 21.76,21.55 21.76,20.43 | v36.36,36.79 38.03,37.66 38.58,37.82
  Bottom 0.813: v36.2,31.31 36.2,31.95 | 35.01,33.77 v35.01,34.57 | C6.02.2 39.51,33.14 v40.17,33.14 | v26.04,21.15 26.04,22.26 | 13.23,19.48 13.76,20.01 | 13.18,19.48 13.18,20.36 v12.15,20.36 13.5,20.36 13.5,21.23 | 15.25,21.23 15.25,20.36 v16.76,20.36 15.41,20.36 15.41,19.48 | v42.87,14.64 41.6,14.64 | v42.87,13.61 40.96,13.69 | v39.06,15.67 40.65,15.59 40.65,14.96 arc90 U4.01.THERMAL | v39.06,14.64 U4.01.THERMAL | v39.06,13.61 39.7,13.61 40.96,13.69 | 40.96,13.69 U4.01.THERMAL | v42.87,15.67 41.35,15.6 41.12,15.59 U4.01.THERMAL | v16.76,21.39 U1.01.PAD v12.15,21.47 | v12.15,19.17 14.45,20.28
  Bottom 1.016: 41.6,14.64 U4.01.THERMAL | R7.11.2 56.28,34.73 | 56.28,34.73 56.28,34.72 | 56.28,34.73 56.84,34.73 v56.84,34.72 | 21.36,20.43 C1.06.2
  Bottom 1.27: X7.02.GND2 X7.02.GND3
  Bottom 1.676: R7.12.2 4.76,18.45 v1.44,18.45 | v12.15,20.36 10.25,18.45 5.09,18.45
  other vias: 14.77,33.06 15.88,33.06 15.88,31.95 56.84,46.71 56.52,51.47 53.35,51.79 44.46,51.79 22.07,51.79 1.75,21.55 1.83,51.39 4.77,51.79 1.59,46.39 1.75,24.09 1.75,1.86 56.68,1.86 53.51,1.55 56.68,6.31 56.68,15.2 56.68,28.22 56.68,21.55 48.11,51.79 53.66,11.47 42.24,19.41 23.66,15.75 23.66,14.32 23.66,12.74 25.73,7.82 4.93,1.47
  pour Route2 (no thermals): 59.3,54.09 58.35,-0.2 -0.07,-0.44 -0.63,53.38
  pour Bottom (no thermals): 37.95,34.41 37.95,33.69 38.74,32.9 40.17,32.9 arc90 40.41,33.14 arc106 40.01,33.38 39.06,34.41
  pour Route3 (isolate 0.254, no thermals): 23.82,22.58 55.25,22.58 55.25,38.77 57.79,38.77 57.79,2.58 arc-90 55.57,0.35 2.87,0.35 arc-90 0.33,2.89 0.33,8.61 2.23,8.61 2.23,3.21 38.74,3.21 arc90 39.06,3.53 39.06,7.34 arc90 36.52,9.88 36.52,18.45 arc90 34.93,20.04 arc-13 24.14,21.63 arc-125
  pour Bottom (rank 6, hatched): 58.43,50.84 58.43,2.58 arc-90 55.89,0.04 2.55,0.04 arc-90 0.01,2.58 0.01,50.84 arc-90 2.55,53.38 55.89,53.38 arc-90
  pour Top (isolate 0.254, rank 6, hatched): 55.89,53.38 arc-90 58.43,50.84 58.43,2.58 arc-90 55.89,0.04 2.55,0.04 arc-90 0.01,2.58 0.01,50.84 arc-90 2.55,53.38
GNDA  (via drill 1 pad 1.68)
  Bottom 0.305: R7.12.1 4.62,15.59 4.61,15.59
  Bottom 1.676: 2.31,12.78 X7.01.1 2.47,15.59 | v1.44,15.59 2.47,15.59 | 4.78,15.59 4.61,15.59 2.47,15.59
GYRO.SCL  (via drill 0.35)
  Top 0.61: v25.05,27.56 25.05,27.53 25.88,26.71 27.78,26.71 30.16,29.09 31.59,29.09 33.02,27.66 33.02,21.63 37.63,17.02 43.34,17.02 44.29,16.07 46.36,16.07 | PAD2.1 46.36,16.07 | 46.36,16.07 46.99,16.07 46.99,15.75 47.31,15.44 47.31,10.51 48.9,8.93 v48.9,8.13 | 48.9,8.45 v48.9,8.13 | R7.19.1 v48.9,8.13
  Bottom 0.305: IC3.01.2 24.62,27.13 v25.05,27.56
  Bottom 0.61: v48.9,8.13 R7.17.1
GYRO.SDA  (via drill 0.35)
  Top 0.61: v33.5,29.09 34.29,28.3 34.29,24.17 35.24,23.21 42.07,23.21 43.34,21.95 43.34,20.04 44.61,18.77 PAD1.1 47.63,18.77 48.42,17.98 48.42,11.15 v51.44,8.13 R7.20.1
  Bottom 0.305: IC3.01.4 24.89,26.27 25.88,25.28 28.1,25.28 28.26,25.44
  Bottom 0.61: 28.26,25.44 29.21,26.39 29.21,28.14 30.16,29.09 v33.5,29.09 | v51.44,8.13 R7.18.1
IC2.0.!CHG  (via drill 0.35)
  Top 0.254: U2.0.13 13.53,33.5 13.34,33.69 13.34,34.01 v13.58,34.33
  Top 0.406: U7.03.2 7.95,29.88 8.58,29.25 v8.58,29.09
  Bottom 0.406: v13.58,34.33 13.1,33.85 12.23,33.85 10.64,32.26 10.64,30.36 9.37,29.09 v8.58,29.09
IC2.0.!PG  (via drill 0.35)
  Top 0.254: U2.0.10 15.13,35.08 14.77,35.44 v14.77,36.23
  Top 0.406: v4.45,31.63 4.45,30.2 4.77,29.88 U7.03.5
  Bottom 0.406: v14.77,36.23 13.98,37.03 12.87,37.03 11.28,35.44 11.28,34.33 10.17,33.22 6.04,33.22 v4.45,31.63
LBO
  Bottom 0.305: X7.02.ADC.0 19.53,50.75 | 36.74,42.96 36.68,42.9 | U6.01.10 36.64,42.84 R6.04.1
  Bottom 0.406: R6.04.1 36.74,42.96 37.95,44.17 37.95,47.82 36.68,49.09 21.12,49.09 19.5,50.71 X7.02.ADC.0
MOT.IN1  (via drill 0.35)
  Top 0.61: X7.02.IO.3 14.42,3.58 16.28,5.43 38.58,5.43 40.17,7.02 v40.17,7.82
  Bottom 0.61: U4.01.3 40.33,9.07 R4.05.2 40.17,8.91 v40.17,7.82
MOT.IN2  (via drill 0.35)
  Top 0.61: X7.02.IO.4 16.99,2.55 16.99,3.37 17.95,4.32 v37.47,4.32
  Bottom 0.406: U4.01.2 41.59,11.78
  Bottom 0.61: 41.59,11.78 41.59,9.24 R4.04.2 41.92,8.91 41.92,7.02 39.22,4.32 v37.47,4.32
N$1
  Bottom 0.254: IC3.01.21 22.29,28.08 21.99,28.37 21.76,28.37 21.52,28.61 C3.01.1
N$2
  Top 0.305: U7.01.6 8.8,22.8 8.58,22.58 8.58,21.95 8.74,21.79 9.68,21.79 10.17,21.3 R7.04.1
  pour Top (no thermals): 8.9,22.74 8.9,21.95 8.74,22.1 8.74,22.58
N$3
  Top 1.016: 34.69,48.54 R7.05.2
  Top 1.27: X7.02.3.3V 34.69,50.73 34.69,48.54
N$4
  Top 0.61: X7.02.5V 32.23,50.75
  Top 1.016: R7.06.2 32.23,48.3
  Top 1.27: 32.23,48.3 32.2,48.33 X7.02.5V
N$5
  Top 0.254: X7.02.VIN 24.61,50.75
  Top 1.016: 24.61,48.54 R7.07.2
  Top 1.27: 24.61,50.75 24.61,48.54
N$6
  Bottom 0.305: 25.33,29.33 C3.02.1 24.91,29.39 23.58,28.06 IC3.01.24
N$7  (via drill 0.35)
  Top 0.61: v9.61,25.36 9.69,25.44 10.88,25.44 11.28,25.04 11.28,24.56
  Bottom 0.61: v9.61,25.36 8.9,24.64 R7.08.1
  pour Top (no thermals): 11.52,24.01 11.52,25.04 10.96,25.6 9.77,25.6 9.61,25.44 9.61,25.28 9.69,25.2 10.72,25.2 10.8,25.12 10.8,24.01
N$8
  Top 0.254: U2.0.4 17.74,32.7 R213.1
N$9
  Bottom 0.813: J4.01.2 47.32,10.2
  Bottom 1.422: 47.32,10.2 X7.05.2
N$10
  Bottom 0.305: C4.04.1 arc-90 39.06,19.48 39.06,18.45 arc-90 38.9,18.29 C4.02.1
  Bottom 0.406: U4.01.5 39.06,18.45
  Bottom 0.813: C4.02.1 35.73,18.29 | C4.01.+ 35.73,16.21 35.73,18.29 | 35.73,18.29 35.13,18.89 L4.01.1
N$11
  Top 0.254: R2.01.2 R2.02.1 11.79,34.25 12.1,34.25 12.34,34.02 12.34,33.22 12.85,32.7 U2.0.15
N$16
  Top 0.61: L2.02.2 17.21,44.59 R2.07.2
N$17
  Bottom 0.254: R3.02.2 R3.01.1 21,23.98 IC3.01.13
N$19
  Top 0.254: U2.0.12 14.33,34.61 13.82,35.12 13.18,35.12 12.87,35.44 12.87,37.82 11.67,39.02 R2.03.2
N$20
  Top 0.254: R2.10.1 R2.11.2 12.78,31.9 U2.0.17
N$21
  Top 0.254: R2.12.1 R2.13.2 12.26,32.03 12.53,32.3 U2.0.16
N$22
  Top 0.254: R2.15.2 R2.14.1 11.71,36.71 12.15,36.71 12.39,36.47 12.39,34.64 12.81,34.22 12.81,33.54 13.25,33.1 U2.0.14
N$23
  Bottom 0.254: IC3.01.5 24.37,25.84 25.57,24.64 26.84,24.64 27.15,24.33 R3.03.1 R3.04.2
N$24
  Bottom 0.254: IC3.01.7 23.58,24.56 23.82,24.33 R3.07.1
N$25  (via drill 1 pad 1.68)
  Bottom 1.016: R7.11.1 55.89,37.57 | 55.89,37.57 X7.04.2 | 55.89,37.57 v56.84,37.57 v56.84,37.58
N$26
  Bottom 0.254: IC3.01.6 24.93,24.34 R3.05.1 R3.06.2
N$27
  Bottom 0.254: IC3.01.8 23.15,24.61 22.87,24.33 22.87,23.63 R3.08.1
N$28
  Top 0.406: U7.03.6 5.31,29.25 4.13,29.25 2.71,30.68 2.71,32.74 2.07,33.38 2.07,33.69 D7.03.C
N$29
  Top 0.305: R7.16.1 7,32.03 6.68,32.03 5.72,32.98 5.72,33.69
  Top 0.406: 5.72,33.69 5.41,34.01 D7.03.A
N$30
  Top 0.406: R7.01.1 6.26,37.56 D7.04.A
N$31  (via drill 0.35)
  Top 0.254: 5.88,31.55 v5.88,31.63
  Top 0.305: 5.96,31.63 v5.88,31.63 5.88,31.23 6.6,30.52 7.21,30.52 U7.03.3
  Top 0.406: v4.93,38.3 2.54,38.3 1.75,37.5 D7.04.C
  Route3 0.406: v4.93,38.3 arc-90 5.88,37.66 v5.88,31.63
N$32
  Top 0.61: R7.13.1 51.02,47.29 D7.05.A
N$33
  Bottom 0.406: C4.05.1 C4.04.2 | 40.25,19.72 C4.04.2 | 41.12,21.15 40.57,19.8 C4.04.2 | 40.33,19.72 C4.04.2
  Bottom 1.016: 40.33,16.87 U4.01.6 40.33,19.48 C4.04.2
  Bottom 1.422: X7.05.1 49.22,12.74 48.11,13.85 48.11,17.34 44.14,21.15 41.12,21.15
N$34
  Bottom 0.406: 43.51,17.5 U4.01.8
  Bottom 1.27: J4.01.3 44.77,12.99 44.77,16.23 43.51,17.5
  pour Bottom (no thermals): 43.51,17.98 42.87,17.98 42.87,16.71 44.14,16.71 44.14,17.34
N$35
  Bottom 0.406: U4.01.4 39.06,10.67 37.31,8.93 R4.03.2
N$36
  Bottom 1.016: L6.02.2 45.81,42.11 44.85,43.06 R6.03.2
N$37
  Bottom 0.406: U6.01.9 35.99,41.37 35.41,41.95 R6.05.1
N$38
  Top 0.61: D7.06.A 47,47.34 47,46.87 47.21,46.65 R7.14.1
N$39
  Bottom 0.305: 40.49,35.08 U6.01.1 40.54,34.49 | L6.01.2 47.47,29.72
  Bottom 0.406: 40.54,34.49 41.18,34.25 41.04,34.01 40.33,34.01 39.89,34.45 U6.01.2
  Bottom 1.016: 41.18,34.25 46.44,34.25 47.68,33.01 L6.01.2
  pour Bottom: 40.33,34.17 40.01,34.49 40.33,34.49 40.65,34.17
N$40
  Bottom 0.406: U6.01.7 36.64,33.99 R6.01.2
N$41
  Bottom 0.305: R6.02.2 35.99,35.76 U6.01.8
N$42
  Top 0.813: R7.04.2 10.07,18.93 5.88,18.93 4.61,20.36 4.61,22.26 4.93,22.58 X7.08.1
N$43
  Bottom 0.305: C6.05.P C6.04.P | C6.03.1 40.65,42.74 | U6.01.14 39.24,41.45 39.22,41.47 39.54,41.79 | 39.54,41.79 39.89,41.79 | U6.01.13 38.58,41.47 38.9,41.79 39.54,41.79
  Bottom 0.406: C6.03.1 39.89,42.56 39.89,41.79 U6.01.15
  Bottom 1.016: C6.05.P 42.68,40.09 L6.02.1 42.44,42.34 41.84,42.34 41.44,42.74 40.65,42.74
  pour Bottom (no thermals): 39.85,41.47 38.74,41.47 38.9,41.63 39.85,41.63
N$44
  Top 0.61: 5.41,7.81 D7.07.A 5.56,7.34 5.56,6.07 5.72,5.91 5.72,5.54 R7.15.1
N$45  (via drill 0.35)
  Top 1.016: X7.11.1 3.66,25.12 3.34,25.44 v3.34,27.34
  Bottom 1.016: X7.10.2 v3.34,27.34 3.34,25.44 3.66,25.12 X7.11.1
N$46  (via drill 0.35)
  Top 0.61: R7.09.2 46.43,23.69 47.16,23.06 v50.25,23.06
  Bottom 0.61: 53.06,24.52 X7.06.1 52.24,24.8 52.24,23.69 51.6,23.06 v50.25,23.06
N$47  (via drill 0.35)
  Top 0.305: U7.2.3 45.88,30.76 46.52,30.76
  Top 0.61: 46.52,30.76 46.92,30.76 47.79,29.88 47.79,28.53 47,27.74 45.33,27.74 v44.93,27.34 | v44.93,24.88 44.08,24.03 R7.09.1
  Route3 0.61: v44.93,27.34 v44.93,24.88
N$48  (via drill 0.35)
  Top 1.016: X7.03.1 53.59,27.34 v54.93,28.69
  Bottom 1.016: X7.09.2 v54.93,28.69 53.59,27.34 X7.03.1
N$49
  Top 0.61: R7.19.2 48.96,5.24 X7.02.SDA
N$50
  Bottom 0.61: R7.08.2 7.52,21.41 6.36,22.58
  Bottom 0.813: 6.52,22.58 6.36,22.58 X7.11.2
N$51
  Top 0.406: U7.2.6 43.02,29.47 arc45 42.87,29.41 42.49,29.02 arc45 42.39,28.8 42.39,27.18 43.58,25.99 R7.10.1
N$52
  Top 0.61: X7.03.2 52.35,24.56 52.11,24.8 49.14,24.8 47.87,25.99 R7.10.2
N$53
  Top 0.61: R7.20.2 51.5,5.24 X7.02.SCL
N$80
  Bottom 1.016: F1.01.2 16.15,10 14.44,11.72 13.18,11.72 L1.01.1
N$81  (via drill 0.35)
  Top 1.27: v17.87,18.06 v17.87,9.24
  Bottom 0.203: U1.01.2 15.09,18.21
  Bottom 0.61: U1.01.2 15.09,17.25 16.16,16.18 16.16,15.02 C1.01.1 | v17.87,18.06 18.03,18.21 R1.01.1
  Bottom 1.016: v17.87,9.24 17.87,12.26 | 17.87,12.26 17.87,13.45 16.84,14.48 16.26,14.48 C1.01.1 | L1.01.2 17.77,12.04 17.87,12.26
N$82  (via drill 0.35)
  Top 0.813: v18.03,21.95 17.39,22.58 16.44,22.58 15.57,23.45 v15.57,24.01
  Bottom 0.305: U1.01.7 15.09,23.53 v15.57,24.01
  Bottom 0.61: R1.01.2 v18.03,21.95
N$83
  Bottom 0.305: U1.01.8 16.54,23.39 17.31,24.17 C1.02.1
N$84
  Bottom 0.305: C1.04.2 14.97,26.67 15.25,26.39 15.25,25.6 15.41,25.44 16.03,25.44 R1.02.2
N$85
  Bottom 0.305: C1.04.1 14.45,24.17 13.82,23.53 U1.01.6
N$86
  Bottom 0.305: R1.03.1 R1.04.2 11.52,23.93 12.53,22.91 12.53,22.76
  Bottom 0.406: U1.01.5 12.53,22.76
N$87
  Bottom 0.305: C1.06.1 20.73,17.66 20.33,17.66 19.06,18.93 19.06,23.14 18.26,23.93 18.26,27.34 17.47,28.3 16.2,28.3 15.33,29.17 14.22,29.17 12.87,27.82 12.87,26.6 R1.03.2 12.82,26.82
  Bottom 0.61: C1.06.1 C1.05.1 | 22.71,17.43 C1.05.1 | 23.02,17.43 C1.05.1
  Bottom 1.016: L1.03.1 25.77,12.7 L1.02.1 25.49,15.99 23.98,17.5 23.09,17.5 23.02,17.43
N$88  (via drill 0.35, 0.35 pad 0.6)
  Bottom 0.305: 19.69,12.58 20.01,12.42 L1.02.2
  Bottom 0.406: v21.91,15.75 20.01,15.73 19.98,15.73
  Bottom 0.61: v21.91,12.9 v21.91,14.32 v21.91,15.75 | v21.91,10.04 v21.91,11.47 v21.91,12.9 | v21.91,12.9 19.69,12.58 | C1.03.2 18.74,16.91 20.01,15.73 | v14.7,13.14 14.7,13.21 14.69,13.21 v14.69,14.4 v14.69,15.67 14.69,16.31 13.82,17.18 U1.01.3 | v14.69,13.13 v15.72,12.18
  pour Route3 (no thermals): 21.91,15.75 21.91,10.04 arc-45 15.49,12.02 arc-53 14.61,12.98 14.45,15.67 arc-90 14.85,15.83 arc19
  pour Bottom (no thermals): 22.23,15.59 22.23,10.04 arc-93 21.91,9.72 arc44 20.8,8.98 19.38,8.98 19.38,15.91 21.91,16.07 arc-90
N$89
  Bottom 0.61: C1.03.1 17.43,16.87 16.99,16.87 16.36,17.5 U1.01.1
N$90
  Bottom 0.305: R1.06.1 R1.05.2
  Bottom 0.61: L1.03.2 27.51,16.9 28.12,17.2 R1.06.1
RAILS.RX
  Top 0.61: 6.8,2.54 X7.02.IO.0 6.8,2.7 9.37,5.27 R7.02.2 10.8,9.88 10.8,12.26 9.37,13.69 R7.03.1
U2.0/BGATE  (via drill 0.35)
  Top 0.254: U2.0.11 14.73,34.85 13.82,35.76 13.68,35.76 v13.61,35.84
  Top 0.406: Q2.01.4 22.75,40.32 21.91,41.15 19.69,41.15 18.89,40.36 v18.89,38.61
  Bottom 0.406: v13.61,35.84 13.76,35.73 13.63,35.73 13.66,35.76 14.61,34.8 17.15,34.8 18.89,36.55 v18.89,38.61
U2.0/BOOT
  Top 0.254: U2.0.2 18.62,31.9 19.21,31.31 19.82,31.31 C2.03.2
U2.0/DRV  (via drill 0.35)
  Top 0.254: U2.0.3 19.09,32.3 19.37,32.58 20.35,32.58 C2.02.1 21.6,32.58 v21.75,32.74
  Top 0.61: R2.04.1 21.84,43.29 v21.91,43.22
  Bottom 0.61: v21.75,32.74 23.02,33.69 21.59,34.8 22.86,36.07 22.86,42.26 v21.91,43.21 v21.91,43.22
U2.0/PMID  (via drill 0.35)
  Top 0.254: v17.94,31.15 17.59,31.5 U2.0.1
  Bottom 0.254: 17.15,29.88 C2.01.1 17.47,30.04 17.47,30.36 17.94,30.84 v17.94,31.15
U2.0/SW
  Top 0.254: 26.37,31.71 L2.01.2 | C2.03.1 21.6,30.2
  Top 0.406: 21.6,30.2 21.12,29.72 19.05,29.72 arc90 18.89,29.88 16.51,29.88 arc-90 16.2,30.2 16.2,30.52
  pour Top (no thermals): 15.97,31.17 15.97,30.34 arc90 16.9,29.41 29.21,29.41 arc90 30.01,30.2 30.01,32.26 22.7,32.26 arc28 22.07,31.79 21.17,31.79 21.17,31.15 arc-90 20.7,30.2 16.83,30.2 arc-90 16.35,30.84 16.34,31.17
U2.0/SYS  (via drill 0.35)
  Top 0.254: U2.0.6 U2.0.7 16.33,34.36 16.85,34.88 16.85,34.89
  Top 0.61: Q2.01.3 25.72,41.59 25.72,36.87 25.26,36.87 L2.01.1
  Top 0.813: C2.04.1 16.85,37.98 16.85,34.89 v16.86,36.16 | v13.84,42.51 v12.34,42.51 12.34,43.93 L2.02.1 | 24.22,35.52 25.72,36.87
  Bottom 0.813: v12.34,42.51 v13.84,42.51 15,42.51 16.86,40.65 v16.86,36.16
  pour Top (no thermals): 23.02,44.17 23.02,41.63 25.72,41.63 25.72,39.09 23.18,39.09 22.07,37.98 22.07,36.55 16.83,36.55 16.83,34.96 16.35,34.49 16.35,33.85 arc90 16.67,33.53 16.99,33.53 arc90 17.62,34.17 17.62,34.33 arc-90 18.42,35.28 28.9,35.28 arc90 29.85,36.55 29.85,37.82 27.15,39.57 27.15,43.22 26.2,44.17
U2.0/TS  (via drill 0.35)
  Top 0.254: U2.0.5 17.36,33.1 v17.95,33.7
  Top 0.305: R2.05.1 20.37,39.96
  Top 0.61: NTC+.1 3.82,42.9 4.45,42.9 7.47,45.92 v17.55,45.92 18.58,45.92 19.4,45.09 R2.08.1 R2.04.2 | 20.37,39.96 20.45,40.04 v21.59,40.04
  Bottom 0.61: v17.95,33.7 17.95,34.18 19.85,36.07 20.8,36.07 21.59,36.87 v21.59,40.04 21.59,41.87 v17.55,45.92
VCC/2
  Bottom 1.27: X7.01.2 4.33,10.24 5.88,11.78 5.88,13.4 D1.01.A

### Text on the board
tNames: EXT.NTC | SPFMDB | BB V2.1 R1 | c | 2017 ESD | MAP1 | MAP1 | MAP2 | TOP | TOP
bNames: ADC5 | ADC4 | ADC3 | ADC2 | ADC1 | !LOBT | +VIN | GND | +5V0 | +3V3 | RST | IOR | NC | +3V3 | +5V | + | + | - | - | MAP2 | TACH | LAPS | + | POWER | - | RRX | AXA | !IRGS | MOTB | MOTA | TLDT | HLDT | LAPS | TACH | JUNC | IO10 | IO11 | IO12 | IO13 | GND | ARF | SDA | SCL
Document: KITT-MB01 PCB LAYOUT | D.Hoeginger/A.Gessler | Kit for Intelligent and / Trainable Trackcars
TOROUTE: RAIL TEST POINTS!!!! | AUXILLARY PORTS ARE NOW ON DB02 AAAAAAAAA | I BETTER PLACE / AN AXIS GUIDE / RIGHT HERE DAMNIT
>:c-SLOTANTENNÆ: FIX UNINTENTIONAL SLOT ANTENNAE